# EAGLE design AnyDiversityProv2 (EAGLE 6.4)
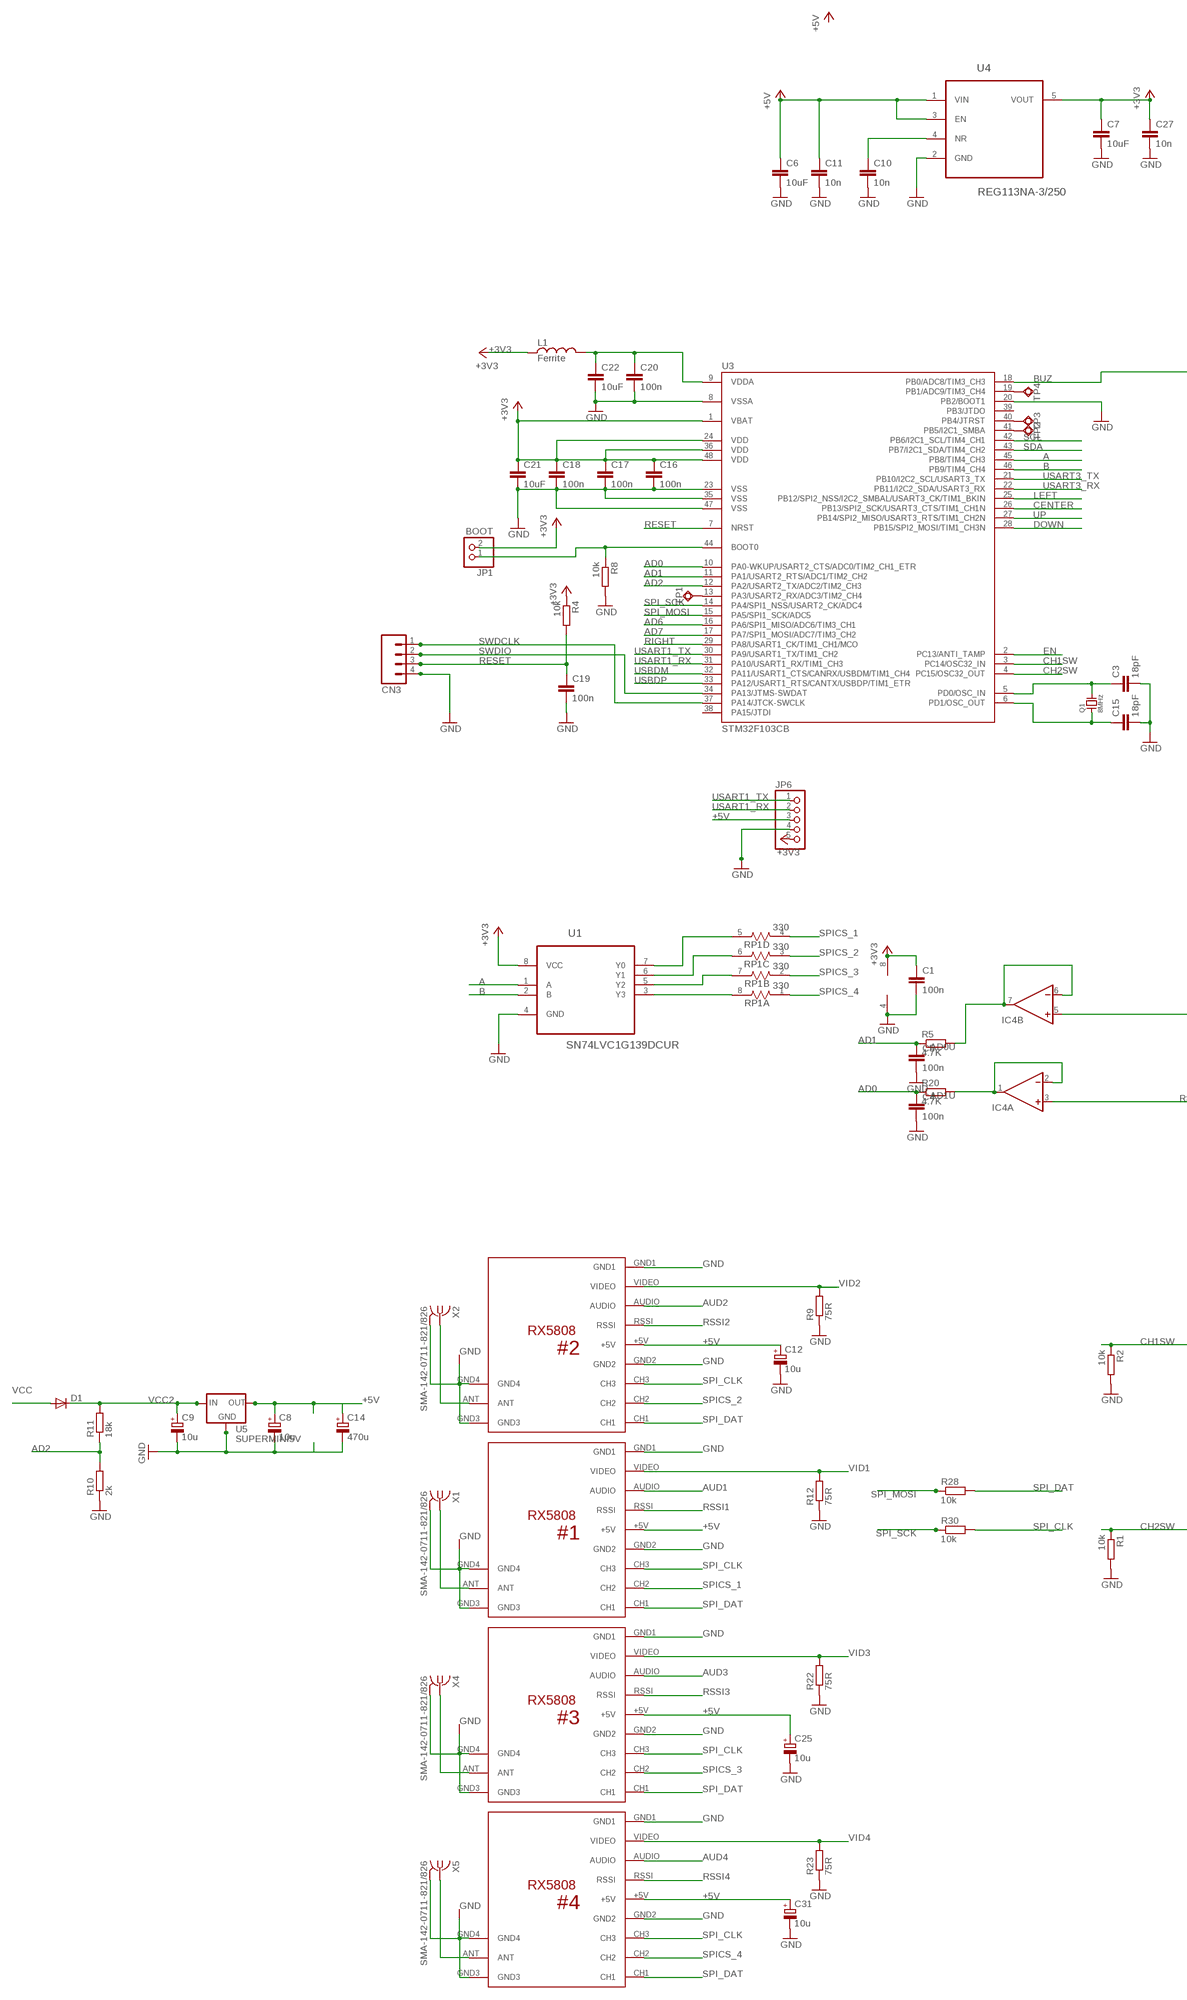
[diagram p0: schematic, sheet 1, part 1 of 3]
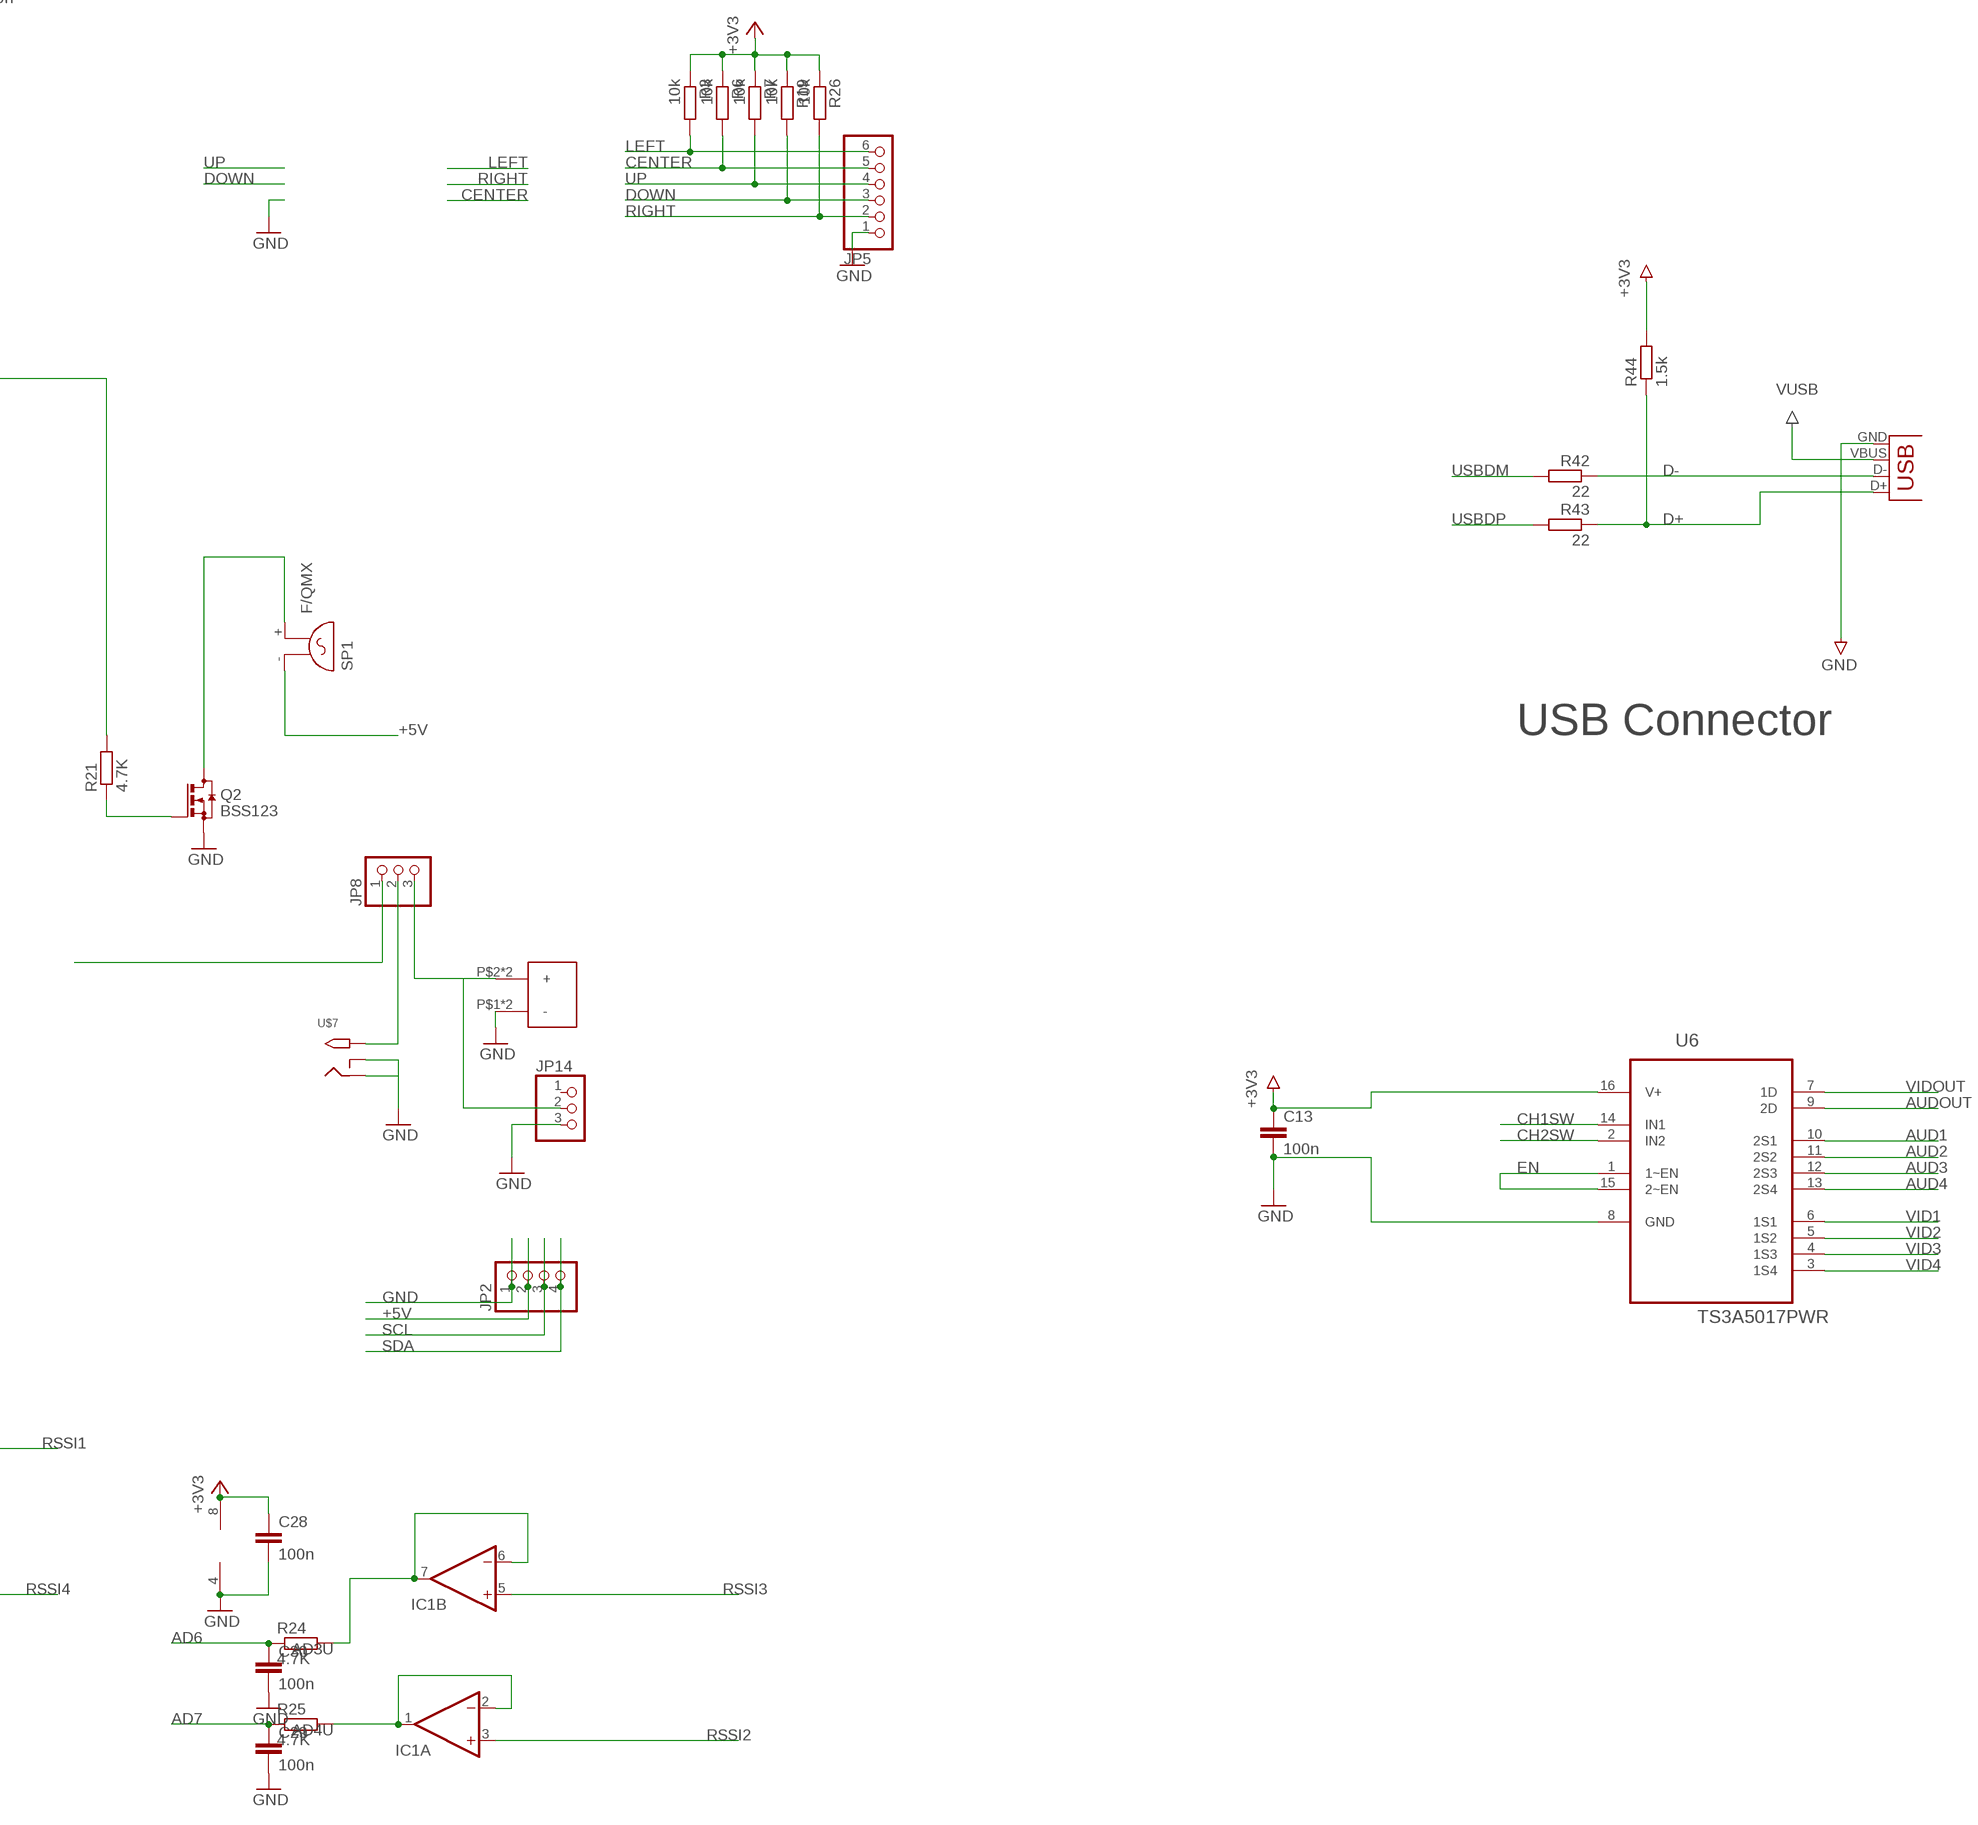
[diagram p1: schematic, sheet 1, part 2 of 3]
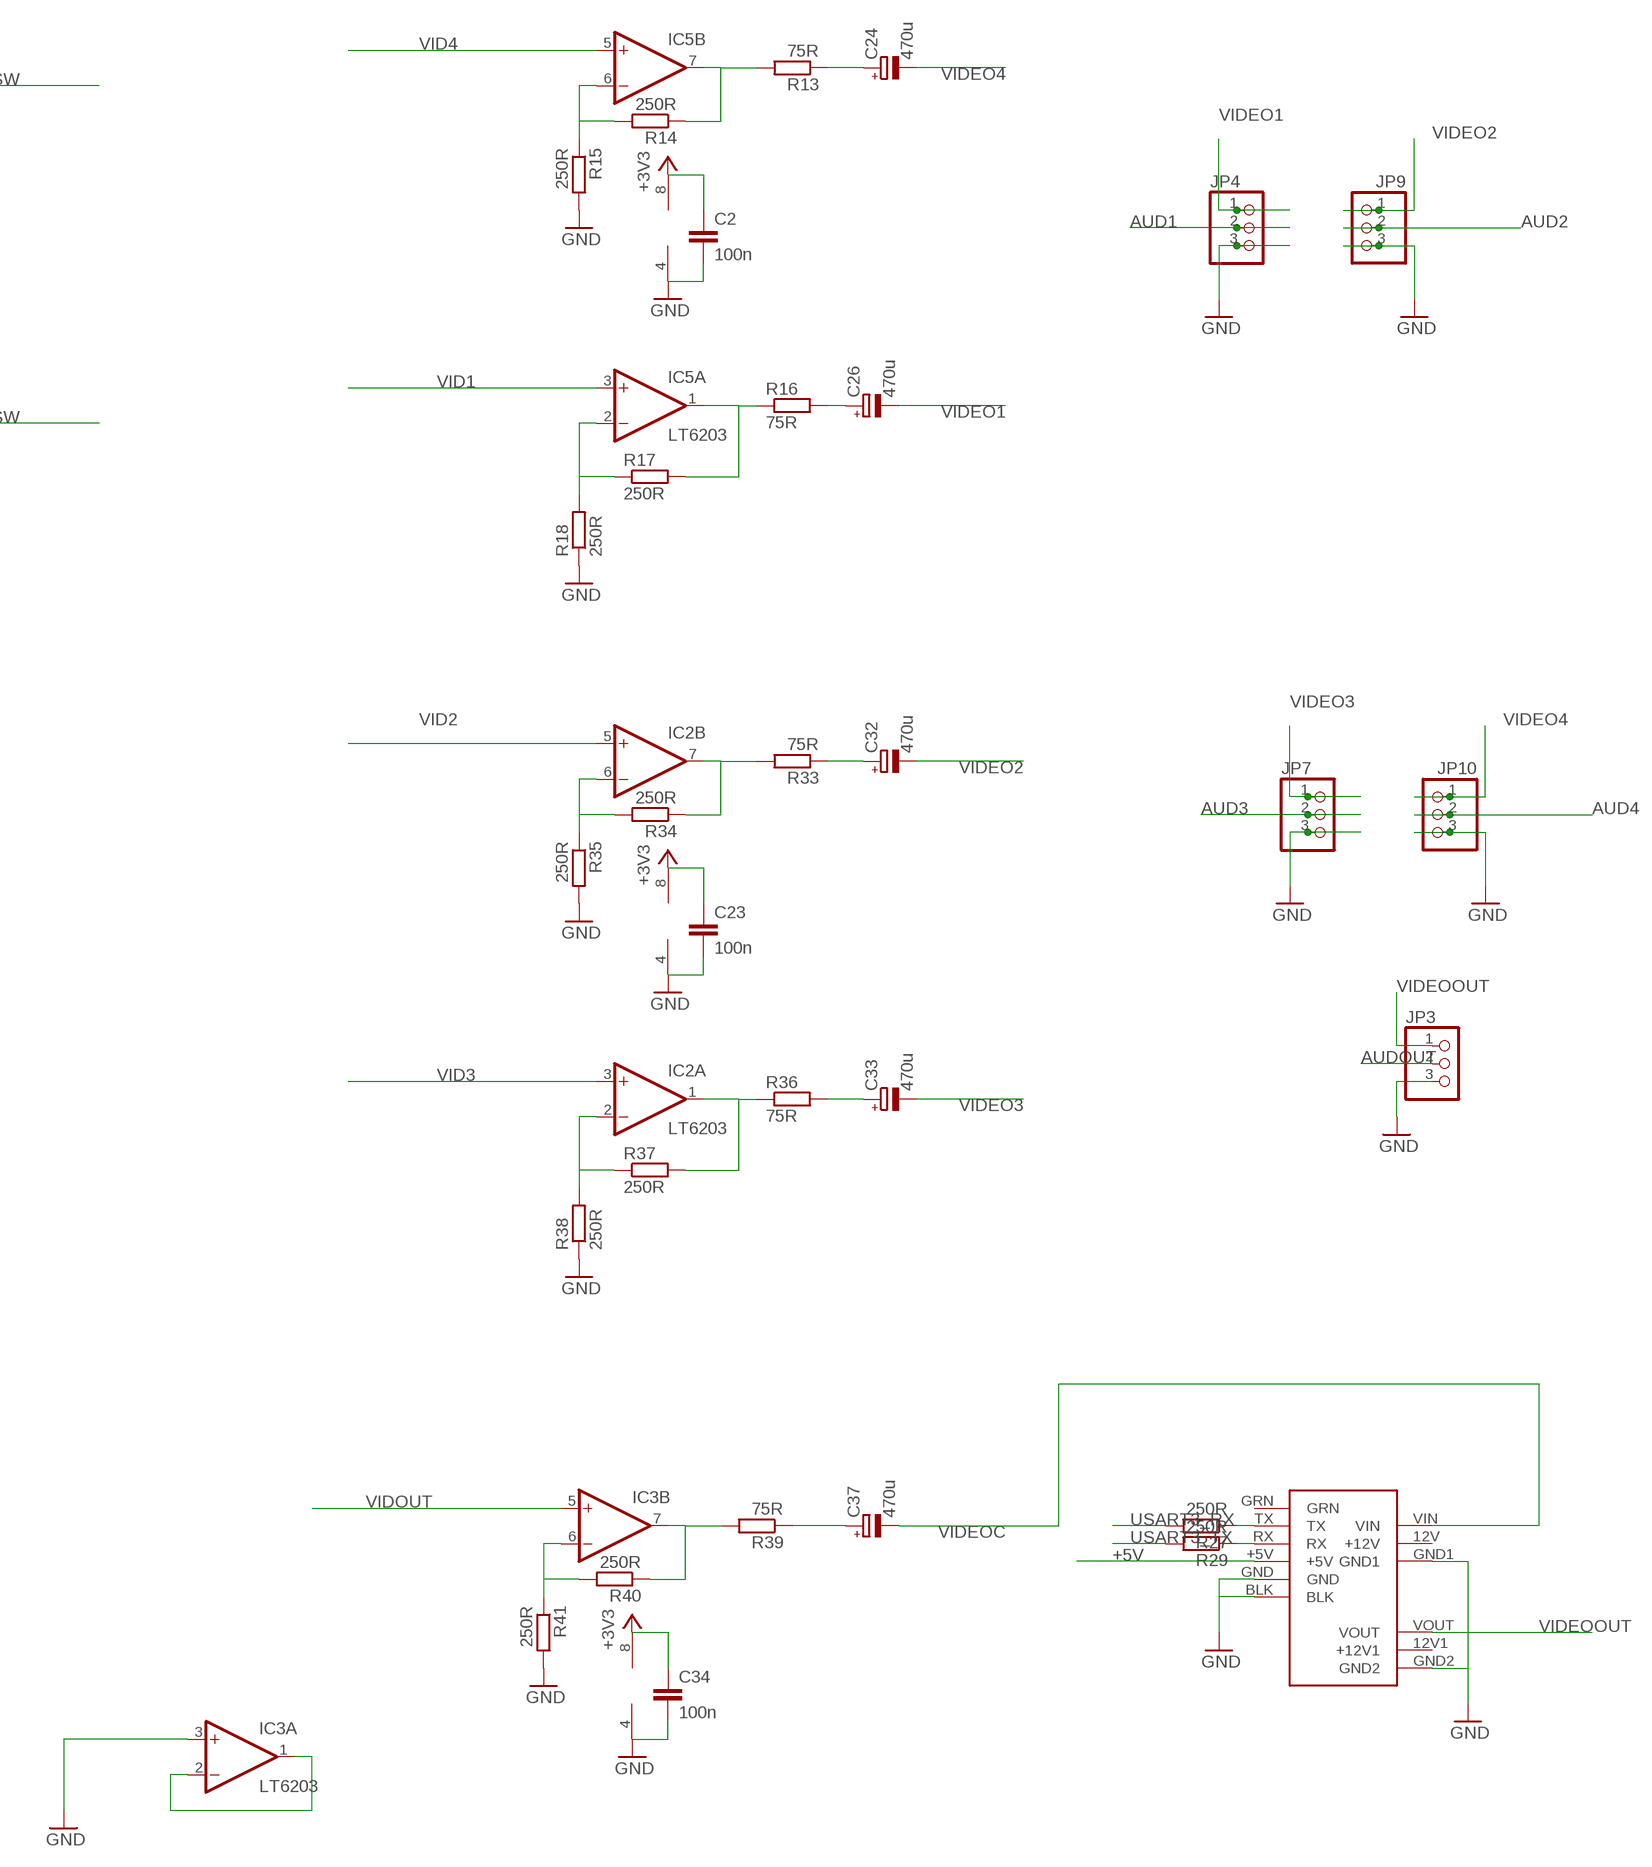
[diagram p2: schematic, sheet 1, part 3 of 3]

## Parts
C1  100n  C-EUC0603K  [C0603K]
C2  100n  C-EUC0603K  [C0603K]
C3  18pF  CAPACITOR0603  [0603]
C4  100n  C-EUC0603K  [C0603K]
C5  100n  C-EUC0603K  [C0603K]
C6  10uF  C-EUC0805K  [C0805K]
C7  10uF  C-EUC0805K  [C0805K]
C8  10u  CPOL-EUA/3216-18W  [A/3216-18W]
C9  10u  CPOL-EUA/3216-18W  [A/3216-18W]
C10  10n  C-EUC0603K  [C0603K]
C11  10n  C-EUC0603K  [C0603K]
C12  10u  CPOL-EUA/3216-18W  [A/3216-18W]
C13  100n  C-EUC0603K  [C0603K]
C14  470u  CPOL-EUE  [PANASONIC_E]
C15  18pF  CAPACITOR0603  [0603]
C16  100n  C-EUC0603K  [C0603K]
C17  100n  C-EUC0603K  [C0603K]
C18  100n  C-EUC0603K  [C0603K]
C19  100n  C-EUC0603K  [C0603K]
C20  100n  C-EUC0603K  [C0603K]
C21  10uF  C-EUC0805K  [C0805K]
C22  10uF  C-EUC0805K  [C0805K]
C23  100n  C-EUC0603K  [C0603K]
C24  470u  CPOL-EUE  [PANASONIC_E]
C25  10u  CPOL-EUA/3216-18W  [A/3216-18W]
C26  470u  CPOL-EUE  [PANASONIC_E]
C27  10n  C-EUC0603K  [C0603K]
C28  100n  C-EUC0603K  [C0603K]
C29  100n  C-EUC0603K  [C0603K]
C30  100n  C-EUC0603K  [C0603K]
C31  10u  CPOL-EUA/3216-18W  [A/3216-18W]
C32  470u  CPOL-EUE  [PANASONIC_E]
C33  470u  CPOL-EUE  [PANASONIC_E]
C34  100n  C-EUC0603K  [C0603K]
C37  470u  CPOL-EUE  [PANASONIC_E]
CN3  SM04B-SRSS-TB  [SM04B-SRSS-TB]
D1  DIODE-DO214AA  [DO214AA]
IC1  LMV358  AD648D  [SO08]
IC2  LT6203  AD648D  [SO08]
IC3  LT6203  AD648D  [SO08]
IC4  LMV358  AD648D  [SO08]
IC5  LT6203  AD648D  [SO08]
JP1  BOOT  PINHD-1X02_2.54-S  [1X02-S]
JP2  PINHD-1X04_2.54-S  [1X04-S]
JP3  PINHD-1X03_2.54-S  [1X03-S]
JP4  PINHD-1X03_2.54-S  [1X03-S]
JP5  PINHD-1X06_2.00  [1X06M]
JP6  PINHD-1X05_2.54-S  [1X05-S]
JP7  PINHD-1X03_2.54-S  [1X03-S]
JP8  PINHD-1X03_2.54-S  [1X03-S]
JP9  PINHD-1X03_2.54-S  [1X03-S]
JP10  PINHD-1X03_2.54-S  [1X03-S]
JP14  PINHD-1X03_2.54-S  [1X03-S]
L1  Ferrite  INDUCTOR0603  [0603]
Q1  8MHz  CRYSTAL-5X3  [CRYSTAL-5X3]
Q2  BSS123  [SOT23]
R1  10k  R-EU_R0603  [R0603]
R2  10k  R-EU_R0603  [R0603]
R3  10k  R-EU_R0603  [R0603]
R4  10k  R-EU_R0603  [R0603]
R5  4.7K  R-EU_R0603  [R0603]
R6  10k  R-EU_R0603  [R0603]
R7  10k  R-EU_R0603  [R0603]
R8  10k  R-EU_R0603  [R0603]
R9  75R  R-EU_R0603  [R0603]
R10  2k  R-EU_R0603  [R0603]
R11  18k  R-EU_R0603  [R0603]
R12  75R  R-EU_R0603  [R0603]
R13  75R  R-EU_R0603  [R0603]
R14  250R  R-EU_R0603  [R0603]
R15  250R  R-EU_R0603  [R0603]
R16  75R  R-EU_R0603  [R0603]
R17  250R  R-EU_R0603  [R0603]
R18  250R  R-EU_R0603  [R0603]
R19  10k  R-EU_R0603  [R0603]
R20  4.7K  R-EU_R0603  [R0603]
R21  4.7K  R-EU_R0603  [R0603]
R22  75R  R-EU_R0603  [R0603]
R23  75R  R-EU_R0603  [R0603]
R24  4.7K  R-EU_R0603  [R0603]
R25  4.7K  R-EU_R0603  [R0603]
R26  10k  R-EU_R0603  [R0603]
R27  250R  R-EU_R0603  [R0603]
R28  10k  R-EU_R0603  [R0603]
R29  250R  R-EU_R0603  [R0603]
R30  10k  R-EU_R0603  [R0603]
R33  75R  R-EU_R0603  [R0603]
R34  250R  R-EU_R0603  [R0603]
R35  250R  R-EU_R0603  [R0603]
R36  75R  R-EU_R0603  [R0603]
R37  250R  R-EU_R0603  [R0603]
R38  250R  R-EU_R0603  [R0603]
R39  75R  R-EU_R0603  [R0603]
R40  250R  R-EU_R0603  [R0603]
R41  250R  R-EU_R0603  [R0603]
R42  22  R-EU_R0603  [R0603]
R43  22  R-EU_R0603  [R0603]
R44  1.5k  R-EU_R0603  [R0603]
RP1  330  RES4NT  [RES4NT]
SP1  F/QMX  [F/QMX]
TP1  TPSQB1,27  [B1,27]
TP2  TPSQB1,27  [B1,27]
TP3  TPSQB1,27  [B1,27]
TP4  TPSQB1,27  [B1,27]
U1  SN74LVC1G139DCUR  [SOP50P310X90-8N]
U3  STM32F103CB  [LQFP48]
U4  REG113NA-3/250  [SOT95P280X145-5N]
U5  SUPERMINI5V  [SUPERMINI5V]
U6  TS3A5017PWR  [SOP65P640X120-16N]
U$1  1CUSTOMSTUFF_RX5808  [1CUSTOMSTUFF_RX5808]
U$2  1CUSTOMSTUFF_RX5808  [1CUSTOMSTUFF_RX5808]
U$3  1CUSTOMSTUFF_RX5808  [1CUSTOMSTUFF_RX5808]
U$4  1CUSTOMSTUFF_RX5808  [1CUSTOMSTUFF_RX5808]
U$5  MINIMOSD  [MINIMOSD]
U$6  XT60  [XT60]
U$7  2.1MMJACKTHM  [PJ-102A]
X1  SMA-142-0711-821/826  [J502-ND-142-0711-821/826]
X2  SMA-142-0711-821/826  [J502-ND-142-0711-821/826]
X3  USBSMD  [USB-MINIB]
X4  SMA-142-0711-821/826  [J502-ND-142-0711-821/826]
X5  SMA-142-0711-821/826  [J502-ND-142-0711-821/826]

## Nets
+3V3: C1.1 C2.1 C7.1 C13.1 C16.1 C17.1 C18.1 C21.1 C23.1 C27.1 C28.1 C34.1 IC1.8(P:V+) IC2.8(P:V+) IC3.8(P:V+) IC4.8(P:V+) IC5.8(P:V+) JP1.2 JP6.5 L1.1 R3.1 R4.1 R6.1 R7.1 R19.1 R26.1 R44.2 U1.8(VCC) U3.1(VBAT) U3.24(VDD) U3.36(VDD) U3.48(VDD) U4.5(VOUT) U6.16(V+)
+5V: C6.1 C8.+ C11.1 C12.+ C14.+ C25.+ C31.+ JP2.2 JP6.3 JP8.1 SP1.- U4.1(VIN) U4.3(EN) U5.1(OUT) U5.2(OUT1) U$1.+5V U$2.+5V U$3.+5V U$4.+5V U$5.+5V
A: U1.1(A) U3.45(PB8/TIM4_CH3)
AD0: C4.1 R20.1 U3.10(PA0-WKUP/USART2_CTS/ADC0/TIM2_CH1_ETR)
AD0U: IC4.6(B:-IN) IC4.7(B:OUT) R5.2
AD1: C5.1 R5.1 U3.11(PA1/USART2_RTS/ADC1/TIM2_CH2)
AD1U: IC4.1(A:OUT) IC4.2(A:-IN) R20.2
AD2: R10.2 R11.1 U3.12(PA2/USART2_TX/ADC2/TIM2_CH3)
AD3U: IC1.6(B:-IN) IC1.7(B:OUT) R24.2
AD4U: IC1.1(A:OUT) IC1.2(A:-IN) R25.2
AD6: C30.1 R24.1 U3.16(PA6/SPI1_MISO/ADC6/TIM3_CH1)
AD7: C29.1 R25.1 U3.17(PA7/SPI1_MOSI/ADC7/TIM3_CH2)
ANT: U$3.ANT X2.1
ANT1: U$2.ANT X1.1
ANT2: U$1.ANT X4.1
ANT3: U$4.ANT X5.1
AUD1: JP4.2 U6.10(2S1) U$2.AUDIO
AUD2: JP9.2 U6.11(2S2) U$3.AUDIO
AUD3: JP7.2 U6.12(2S3) U$1.AUDIO
AUD4: JP10.2 U6.13(2S4) U$4.AUDIO
AUDOUT: JP3.2 U6.9(2D)
B: U1.2(B) U3.46(PB9/TIM4_CH4)
BUZ: R21.2 U3.18(PB0/ADC8/TIM3_CH3)
CENTER: JP5.5 R6.2 U3.26(PB13/SPI2_SCK/USART3_CTS/TIM1_CH1N)
CH1SW: R2.1 U3.3(PC14/OSC32_IN) U6.14(IN1)
CH2SW: R1.1 U3.4(PC15/OSC32_OUT) U6.2(IN2)
D+: R43.1 R44.1 X3.D+
D-: R42.1 X3.D-
DOWN: JP5.3 R19.2 U3.28(PB15/SPI2_MOSI/TIM1_CH3N)
EN: U3.2(PC13/ANTI_TAMP) U6.1(1~EN) U6.15(2~EN)
GND: C1.2 C2.2 C3.2 C4.2 C5.2 C6.2 C7.2 C8.- C9.- C10.2 C11.2 C12.- C13.2 C14.- C15.2 C16.2 C17.2 C18.2 C19.2 C20.2 C21.2 C22.2 C23.2 C25.- C27.2 C28.2 C29.2 C30.2 C31.- C34.2 CN3.4 IC1.4(P:V-) IC2.4(P:V-) IC3.3(A:+IN) IC3.4(P:V-) IC4.4(P:V-) IC5.4(P:V-) JP2.1 JP3.3 JP4.3 JP5.1 JP6.4 JP7.3 JP9.3 JP10.3 JP14.3 Q2.2(S) R1.2 R2.2 R8.2 R9.1 R10.1 R12.1 R15.2 R18.1 R22.1 R23.1 R35.2 R38.1 R41.2 U1.4(GND) U3.8(VSSA) U3.20(PB2/BOOT1) U3.23(VSS) U3.35(VSS) U3.47(VSS) U4.2(GND) U5.5(GND) U5.6(GND1) U5.7(GND2) U5.8(GND3) U6.8(GND) U$1.GND1 U$1.GND2 U$1.GND3 U$1.GND4 U$2.GND1 U$2.GND2 U$2.GND3 U$2.GND4 U$3.GND1 U$3.GND2 U$3.GND3 U$3.GND4 U$4.GND1 U$4.GND2 U$4.GND3 U$4.GND4 U$5.BLK U$5.GND U$5.GND1 U$5.GND2 U$6.P$1(-) U$6.P$3(-) U$7.RING U$7.RING_SW X1.G@1 X1.G@2 X1.G@3 X1.G@4 X2.G@1 X2.G@2 X2.G@3 X2.G@4 X3.GND X4.G@1 X4.G@2 X4.G@3 X4.G@4 X5.G@1 X5.G@2 X5.G@3 X5.G@4
LEFT: JP5.6 R3.2 U3.25(PB12/SPI2_NSS/I2C2_SMBAL/USART3_CK/TIM1_BKIN)
N$1: C26.+ R16.2
N$2: C24.+ R13.1
N$3: C10.1 U4.4(NR)
N$4: Q2.1(G) R21.1
N$5: Q2.3(D) SP1.+
N$6: RP1.5 U1.7(Y0)
N$7: RP1.6 U1.6(Y1)
N$8: IC2.6(B:-IN) R34.2 R35.1
N$9: IC2.7(B:OUT) R33.2 R34.1
N$10: IC2.2(A:-IN) R37.1 R38.2
N$11: IC2.1(A:OUT) R36.1 R37.2
N$12: RP1.7 U1.5(Y2)
N$13: C33.+ R36.2
N$14: RP1.8 U1.3(Y3)
N$15: C32.+ R33.1
N$16: R29.1 U$5.RX
N$17: R27.1 U$5.TX
N$19: IC5.6(B:-IN) R14.2 R15.1
N$20: IC3.6(B:-IN) R40.2 R41.1
N$21: IC5.7(B:OUT) R13.2 R14.1
N$22: IC5.2(A:-IN) R17.1 R18.2
N$24: IC5.1(A:OUT) R16.1 R17.2
N$25: C20.1 C22.1 L1.2 U3.9(VDDA)
N$26: JP1.1 R8.1 U3.44(BOOT0)
N$27: IC3.7(B:OUT) R39.2 R40.1
N$28: IC3.1(A:OUT) IC3.2(A:-IN)
N$29: JP8.2 U$7.TIP
N$30: C3.1 Q1.3 U3.5(PD0/OSC_IN)
N$31: C37.+ R39.1
N$32: C15.1 Q1.1 U3.6(PD1/OSC_OUT)
N$33: TP1.TP U3.13(PA3/USART2_RX/ADC3/TIM2_CH4)
N$34: TP3.TP U3.40(PB4/JTRST)
N$35: TP4.TP U3.19(PB1/ADC9/TIM3_CH4)
N$36: TP2.TP U3.41(PB5/I2C1_SMBA)
RESET: C19.1 CN3.3 R4.2 U3.7(NRST)
RIGHT: JP5.2 R26.2 U3.29(PA8/USART1_CK/TIM1_CH1/MCO)
RSSI1: IC4.5(B:+IN) U$2.RSSI
RSSI2: IC1.3(A:+IN) U$3.RSSI
RSSI3: IC1.5(B:+IN) U$1.RSSI
RSSI4: IC4.3(A:+IN) U$4.RSSI
SCL: JP2.3 U3.42(PB6/I2C1_SCL/TIM4_CH1)
SDA: JP2.4 U3.43(PB7/I2C1_SDA/TIM4_CH2)
SPI_CLK: R30.2 U$1.CH3 U$2.CH3 U$3.CH3 U$4.CH3
SPI_DAT: R28.2 U$1.CH1 U$2.CH1 U$3.CH1 U$4.CH1
SPI_MOSI: R28.1 U3.15(PA5/SPI1_SCK/ADC5)
SPI_SCK: R30.1 U3.14(PA4/SPI1_NSS/USART2_CK/ADC4)
SPICS_1: RP1.4 U$2.CH2
SPICS_2: RP1.3 U$3.CH2
SPICS_3: RP1.2 U$1.CH2
SPICS_4: RP1.1 U$4.CH2
SWDCLK: CN3.1 U3.37(PA14/JTCK-SWCLK)
SWDIO: CN3.2 U3.34(PA13/JTMS-SWDAT)
UP: JP5.4 R7.2 U3.27(PB14/SPI2_MISO/USART3_RTS/TIM1_CH2N)
USART1_RX: JP6.2 U3.31(PA10/USART1_RX/TIM1_CH3)
USART1_TX: JP6.1 U3.30(PA9/USART1_TX/TIM1_CH2)
USART3_RX: R27.2 U3.22(PB11/I2C2_SDA/USART3_RX)
USART3_TX: R29.2 U3.21(PB10/I2C2_SCL/USART3_TX)
USBDM: R42.2 U3.32(PA11/USART1_CTS/CANRX/USBDM/TIM1_CH4)
USBDP: R43.2 U3.33(PA12/USART1_RTS/CANTX/USBDP/TIM1_ETR)
VCC: D1.A JP8.3 JP14.2 U$6.P$2(+) U$6.P$4(+)
VCC2: C9.+ D1.C R11.2 U5.3(IN) U5.4(IN1)
VID1: IC5.3(A:+IN) R12.2 U6.6(1S1) U$2.VIDEO
VID2: IC2.5(B:+IN) R9.2 U6.5(1S2) U$3.VIDEO
VID3: IC2.3(A:+IN) R22.2 U6.4(1S3) U$1.VIDEO
VID4: IC5.5(B:+IN) R23.2 U6.3(1S4) U$4.VIDEO
VIDEO1: C26.- JP4.1
VIDEO2: C32.- JP9.1
VIDEO3: C33.- JP7.1
VIDEO4: C24.- JP10.1
VIDEOC: C37.- U$5.VIN
VIDEOOUT: JP3.1 U$5.VOUT
VIDOUT: IC3.5(B:+IN) U6.7(1D)
VUSB: X3.VBUS
Unconnected: JP14.1 U3.38(PA15/JTDI) U3.39(PB3/JTDO) U$5.12V1(+12V1) U$5.12V(+12V) U$5.GRN

## Notes on the sheet
- USB Connector
- #2
- #1
- #3
- #4

## Library data of the parts
C1 C2 C4-C7 C10 C11 C13 C16-C23 C27-C30 C34 = rcl:C-EU: CAPACITOR, European symbol
C3 C15 = OpenPilot:CAPACITOR: Capacitor Standard SMD ceramic capacitors.
C8 C9 C12 C14 C24-C26 C31-C33 C37 = rcl:CPOL-EU: POLARIZED CAPACITOR, European symbol
CN3 = AnyDiversity4:SM04B-SRSS-TB: JST SR Connector 4 pins, SMT (Side entry)
D1 = diode:DIODE-: DIODE
IC1-IC5 = linear:AD648: OP AMP
JP1 = pinhead-2:PINHD-1X02: PIN HEADER
JP2 = pinhead-2:PINHD-1X04: PIN HEADER
JP3 JP4 JP7-JP10 JP14 = pinhead-2:PINHD-1X03: PIN HEADER
JP5 = pinhead-2:PINHD-1X06: PIN HEADER
JP6 = pinhead-2:PINHD-1X05: PIN HEADER
L1 = OpenPilot:INDUCTOR
Q1 = OpenPilot:CRYSTAL: 5x3 Part: Digikey part: CTX639CT-ND or 535-9720-1-ND
Q2 = transistor-small-signal:BSS123: N-CHANNEL MOS FET
R1-R30 R33-R44 = rcl:R-EU_: RESISTOR, European symbol
RP1 = MySMD:RES4NT
SP1 = buzzer:F/QMX: BUZZER Source: Buerklin; OC_FARNELL: unknown; OC_NEWARK: unknown
TP1-TP4 = testpad:TPSQ: Test pad
U1 = SN74LVC1G139DCUR:SN74LVC1G139DCUR: 2-TO-4 LINE DECODER,VSSOP-8; MPN: SN74LVC1G139DCUR; OC_FARNELL: Unknown; OC_NEWARK: 94T5047; PACKAGE: VSSOP-8; SUPPLIER: TEXAS INSTRUMENTS
U3 = AnyDiversity4:STM32F103C: ST Microelectronics STM32 Device: STM32F103Cx Package: 48LQFP
U4 = REG113NA:REG113NA-3/250: DMOS 400mA Low-Dropout Regulator; MPN: REG113NA-3/250; OC_FARNELL: 1575540; OC_NEWARK: 75C7591; PACKAGE: SOT-23-5; SUPPLIER: Texas Instruments
U5 = AnyDiversity4:SUPERMINI5V
U6 = TS3A5017PWR:TS3A5017PWR: Dual single-pole quadruple-throw analog switch; MPN: TS3A5017PWR; OC_FARNELL: 1755402; OC_NEWARK: 34R9265; PACKAGE: TSSOP-16; SUPPLIER: Texas Instruments
U$1-U$4 = AnyDiversity4:1CUSTOMSTUFF_RX5808
U$5 = MinimOSD:MINIMOSD
U$6 = AnyDiversity4:XT60
U$7 = adafruit:2.1MMJACK: 2.1mm x 5.5mm THM DC jack with internal switch. Digikey part #PJ-102A, 4UCON part #05537 2.1mm x 5.5mm SMT DC jack with internal switch. Digikey part #PJ-002A-SMT, 4UCON part #03267 By microbuilder.eu & adafruit.com
X1 X2 X4 X5 = con-coax:SMA-: SMA 50 Ohm End Launch Jack Receptacle - Round Contact Johnson Components Source: www.johnsoncomponents.com .. J502-ND.pdf; MF: JOHNSON COMPONENTS; MPN: 142-0711-821; OC_FARNELL: 1019328; OC_NEWARK: 16F3627
X3 = sparkfun:USB: USB Connectors USB-B-PTH is fully proven SKU : PRT-00139 USB-miniB is fully proven SKU : PRT-00587 USB-A-PCB is untested. USB-A-H is throughly reviewed, but untested. Spark Fun Electronics SKU : PRT-00437 USB-B-SMT is throughly reviewed, but untested. Needs silkscreen touching up. USB-A-S has not been used/tested USB-MB-H has not been used/tested

## Net classes
1 power: width 0.254 mm, drill 0.33 mm, clearance 0.152 mm

## Board
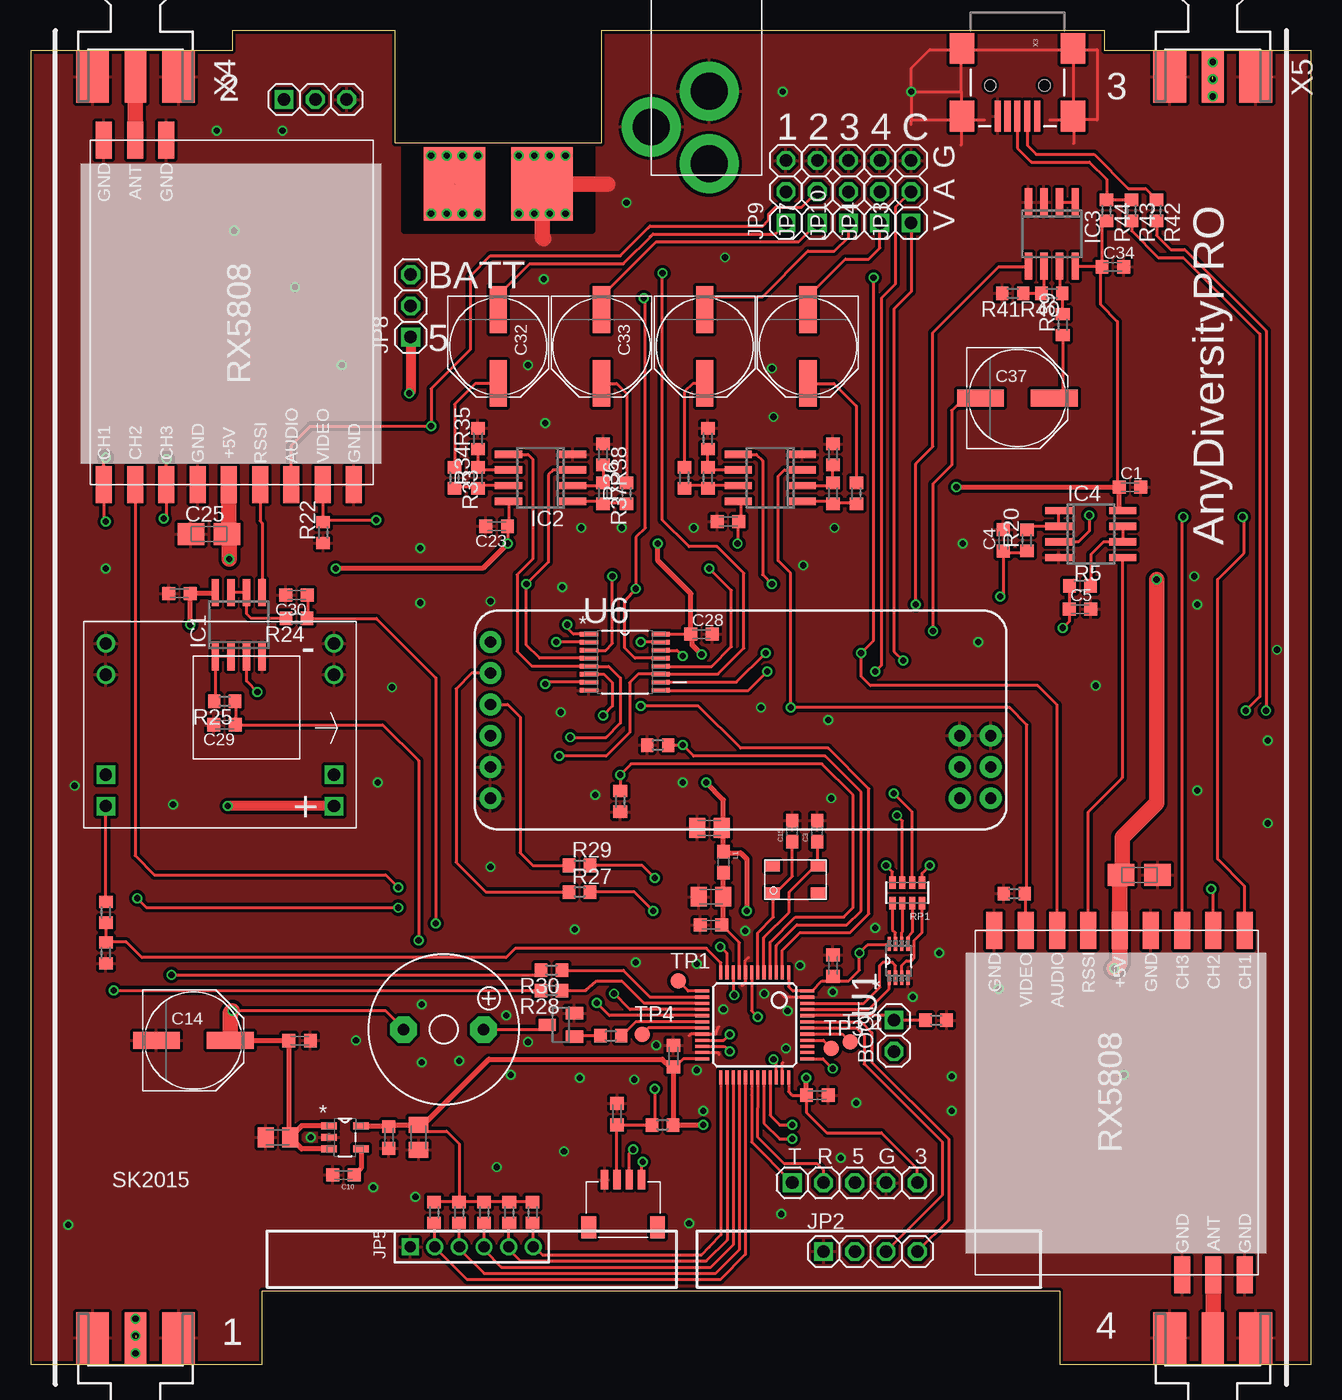
[diagram p3: board, top side]
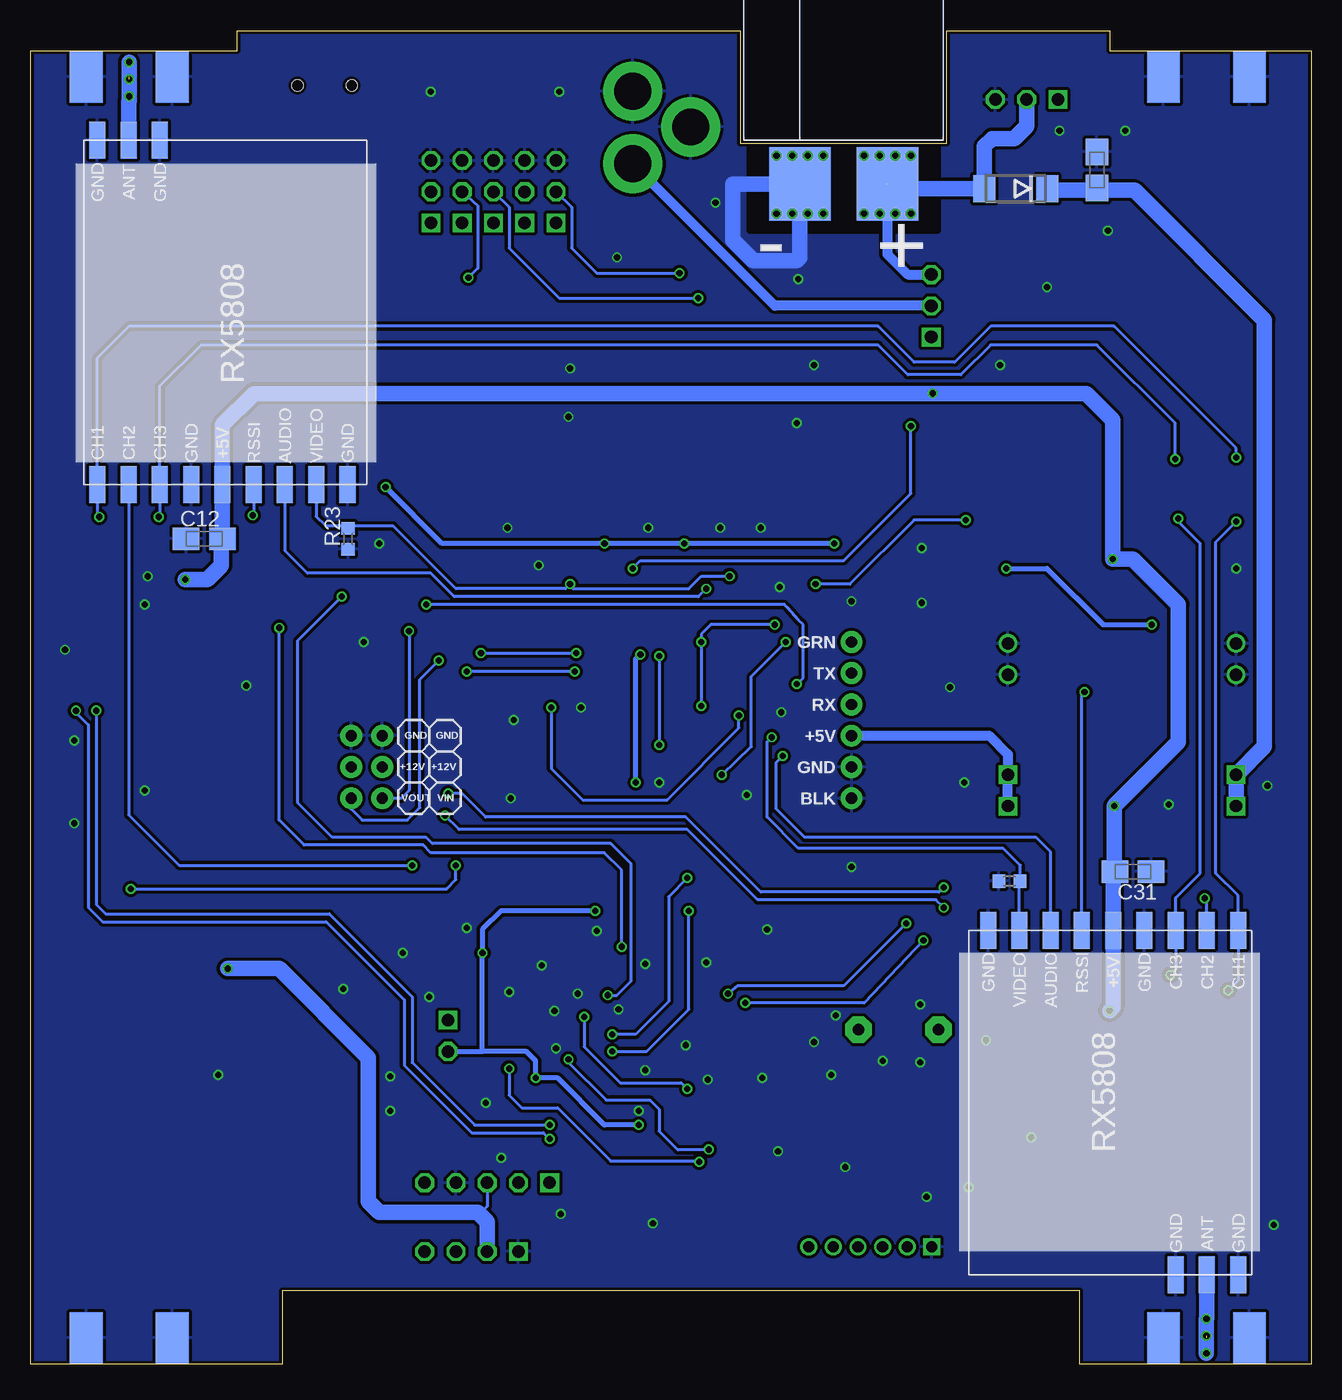
[diagram p4: board, bottom side, seen from below]

Size 104 x 108.33 mm. Coordinates in mm from the lower left corner, seen from the top.
Outline: 104,0 104,106.7 87.25,106.7 87.25,108.33 46.35,108.33 46.35,99.19 29.59,99.19 29.59,108.33 16.38,108.33 16.38,106.7 0,106.7 0,0 18.8,0 18.8,5.97 83.57,5.97 83.57,0 104,0
Copper layers (1*2*15*16): Top 0.035mm / dielectric 0.2mm / Route2 0.0175mm / dielectric 1.1mm / Route15 0.0175mm / dielectric 0.2mm / Bottom 0.035mm
Design rules "SeeedStudio_DRU_no_angle_20130527": minimum track width 6mil, minimum drill 12mil, track to track 6mil, track to pad 6mil, pad to pad 6mil, via to via 6mil, smd to smd 0mil, copper to edge 10mil, drill to drill 10mil, minimum pad ring 6mil, minimum via ring 6mil, stop-mask expansion 2mil, vias tented up to drill 25mil, thermal gap 10mil

### Footprints (pad centres in the part's own frame; a part is rotated, then mirrored left to right if it is on the bottom)
C0603K = smd 1.05 x 1.08: 1 -0.875,0; 2 0.875,0
0603 = smd 1.1 x 1: 1 -0.85,0; 2 0.85,0
C0805K = smd 1.3 x 1.6: 1 -1,0; 2 1,0
A/3216-18W = smd 2.15 x 1.8: + 1.475,0; - -1.475,0
PANASONIC_E = smd 3.8 x 1.4: + 3,0; - -3,0
SM04B-SRSS-TB = smd 0.6 x 1.55: 1 3,0; 2 2,0; 3 1,0; 4 0,0 | smd 1.2 x 1.8: NC@1 -1.3,-3.875; NC@2 4.3,-3.875
DO214AA = smd 1.8 x 2.2: A 2.55,0; C -2.55,0
SO08 = smd 0.6 x 2.2: 1 -1.905,-2.6; 2 -0.635,-2.6; 3 0.635,-2.6; 4 1.905,-2.6; 5 1.905,2.6; 6 0.635,2.6; 7 -0.635,2.6; 8 -1.905,2.6
1X02-S = drill 1.016 square: 1 -1.27,0 | drill 1.016 octagon: 2 1.27,0
1X04-S = drill 1.016 square: 1 -3.81,0 | drill 1.016 octagon: 2 -1.27,0; 3 1.27,0; 4 3.81,0
1X03-S = drill 1.016 square: 1 -2.54,0 | drill 1.016 octagon: 2 0,0; 3 2.54,0
1X06M = drill 0.914 square: 1 -5,0 | drill 0.914: 2 -3,0; 3 -1,0; 4 1,0; 5 3,0; 6 5,0
1X05-S = drill 1.016 square: 1 -5.08,0 | drill 1.016 octagon: 2 -2.54,0; 3 0,0; 4 2.54,0; 5 5.08,0
CRYSTAL-5X3 = smd 1.2 x 0.9: 1 1.85,1.1; 2 -1.85,1.1; 3 -1.85,-1.1; 4 1.85,-1.1
SOT23 = smd 1 x 1.4: 1 -0.95,-1.1; 2 0.95,-1.1; 3 0,1.1
R0603 = smd 1 x 1.1: 1 -0.85,0; 2 0.85,0
RES4NT = smd 0.508 x 1.016: 1 0,0; 2 0.8,0; 3 1.6,0; 4 2.4,0; 5 2.4,1.651; 6 1.6,1.651; 7 0.8,1.651; 8 0,1.651
F/QMX = drill 0.914 pad 2.159 octagon: + 3.251,0; - -3.251,0
B1,27 = smd 1.27 x 1.27: TP 0,0
SOP50P310X90-8N = smd 1.168 x 0.254: 1 -1.372,0.762; 2 -1.372,0.254; 3 -1.372,-0.254; 4 -1.372,-0.762; 5 1.372,-0.762; 6 1.372,-0.254; 7 1.372,0.254; 8 1.372,0.762
LQFP48 = smd 1.143 x 0.254: 1 -4.25,2.75; 2 -4.25,2.25; 3 -4.25,1.75; 4 -4.25,1.25; 5 -4.25,0.75; 6 -4.25,0.25; 7 -4.25,-0.25; 8 -4.25,-0.75; 9 -4.25,-1.25; 10 -4.25,-1.75; 11 -4.25,-2.25; 12 -4.25,-2.75; 25 4.25,-2.75; 26 4.25,-2.25; 27 4.25,-1.75; 28 4.25,-1.25; 29 4.25,-0.75; 30 4.25,-0.25; 31 4.25,0.25; 32 4.25,0.75; 33 4.25,1.25; 34 4.25,1.75; 35 4.25,2.25; 36 4.25,2.75 | smd 0.254 x 1.143: 13 -2.75,-4.25; 14 -2.25,-4.25; 15 -1.75,-4.25; 16 -1.25,-4.25; 17 -0.75,-4.25; 18 -0.25,-4.25; 19 0.25,-4.25; 20 0.75,-4.25; 21 1.25,-4.25; 22 1.75,-4.25; 23 2.25,-4.25; 24 2.75,-4.25; 37 2.75,4.25; 38 2.25,4.25; 39 1.75,4.25; 40 1.25,4.25; 41 0.75,4.25; 42 0.25,4.25; 43 -0.25,4.25; 44 -0.75,4.25; 45 -1.25,4.25; 46 -1.75,4.25; 47 -2.25,4.25; 48 -2.75,4.25
SOT95P280X145-5N = smd 1.27 x 0.559: 1 -1.295,0.94; 2 -1.295,0; 3 -1.295,-0.94; 4 1.295,-0.94; 5 1.295,0.94
SUPERMINI5V = drill 1 square: 1 0,0; 2 0,-2.54; 3 18.542,0; 4 18.542,-2.54 | drill 1: 5 0,-10.668; 6 0,-13.208; 7 18.542,-10.668; 8 18.542,-13.208
SOP65P640X120-16N = smd 1.473 x 0.356: 1 -2.921,2.286; 2 -2.921,1.626; 3 -2.921,0.965; 4 -2.921,0.33; 5 -2.921,-0.33; 6 -2.921,-0.965; 7 -2.921,-1.626; 8 -2.921,-2.286; 9 2.921,-2.286; 10 2.921,-1.626; 11 2.921,-0.965; 12 2.921,-0.33; 13 2.921,0.33; 14 2.921,0.965; 15 2.921,1.626; 16 2.921,2.286
1CUSTOMSTUFF_RX5808 = smd 3 x 1.3: +5V 28,11.26; ANT 0,3.64; AUDIO 28,16.34; CH1 28,1.1; CH2 28,3.64; CH3 28,6.18; GND1 28,21.42; GND2 28,8.72; GND3 0,1.1; GND4 0,6.18; RSSI 28,13.8; VIDEO 28,18.88
MINIMOSD = drill 0.9 pad 1.778: 12V 19.05,-4.445; 12V1 21.59,-4.445; +5V -19.05,-1.905; BLK -19.05,-6.985; GND -19.05,-4.445; GND1 19.05,-1.905; GND2 21.59,-1.905; GRN -19.05,5.715; RX -19.05,0.635; TX -19.05,3.175; VIN 19.05,-6.985; VOUT 21.59,-6.985
XT60 = smd 5 x 6: P$1 -3.55,0; P$2 3.55,0 | smd 5 x 6 bottom: P$3 -3.55,0; P$4 3.55,0
PJ-102A = drill 3 pad 4.8: RING 0.1,-3.39; RING_SW -4.6,-6.29; TIP 0.1,-9.29
J502-ND-142-0711-821/826 = smd 4.191 x 1.778: 1 2.115,0 | smd 4.191 x 2.667: G@1 2.115,3.495; G@2 2.115,-3.495 | smd 4.191 x 2.667 bottom: G@3 2.115,3.495; G@4 2.115,-3.495
USB-MINIB = smd 2.5 x 0.5: D+ 2.5,0; D- 2.5,0.8; GND 2.5,-1.6; ID 2.5,-0.8; VBUS 2.5,1.6 | smd 2.5 x 2: GND@1 -3,-4.5; GND@2 -3,4.5; GND@3 2.5,4.5; GND@4 2.5,-4.5 | hole 0.9: 0,2.2; 0,-2.2

### Placement (x,y rotation side)
C1  89.28,71.25 0 top
C2  56.64,68.45 180 top
C3  63.88,43.31 90 top
C4  78.99,66.93 90 top
C5  85.22,61.34 0 top
C6  20.07,18.41 180 top
C7  31.5,18.41 270 top
C8  90.04,39.75 180 top
C9  17.4,97.03 270 bottom
C10  25.4,15.37 180 top
C11  21.84,26.29 0 top
C12  89.92,67.06 0 bottom
C13  12.06,62.61 180 top
C14  13.21,26.29 0 top
C15  61.85,43.31 90 top
C16  52.2,25.02 90 top
C17  65.15,32.38 90 top
C18  63.88,21.84 0 top
C19  47.62,20.32 90 top
C20  55.24,35.69 180 top
C21  55.12,43.56 180 top
C22  55.24,37.97 180 top
C23  37.85,68.07 180 top
C24  54.74,82.68 270 top
C25  14.48,67.44 0 top
C26  63.12,82.68 270 top
C27  29.08,18.41 270 top
C28  54.48,59.31 0 top
C29  15.75,51.94 180 top
C30  21.59,62.48 180 top
C31  14.48,40 180 bottom
C32  37.97,82.68 270 top
C33  46.35,82.68 270 top
C34  87.88,89.15 0 top
C37  80.14,78.49 0 top
CN3  46.61,14.99 0 top
D1  24,95.5 180 bottom
IC1  16.89,60.07 0 top
IC2  41.4,72.01 90 top
IC3  82.93,91.82 180 top
IC4  86.11,67.44 270 top
IC5  60.07,72.01 90 top
JP1  70.1,26.67 270 top
JP2  68.2,9.14 0 top
JP3  71.5,95.25 90 top
JP4  68.96,95.25 90 top
JP5  35.81,9.53 0 top
JP6  66.93,14.73 0 top
JP7  63.88,95.25 90 top
JP8  30.86,85.98 90 top
JP9  61.34,95.25 90 top
JP10  66.42,95.25 90 top
JP14  23.11,102.74 0 top
L1  56.26,40.77 270 top
Q1  62.1,39.37 180 top
Q2  43.05,27.56 90 top
R1  47.88,45.72 270 top
R2  50.93,50.29 180 top
R3  40.77,12.32 270 top
R4  51.31,19.43 180 top
R5  85.22,63.25 0 top
R6  38.86,12.32 270 top
R7  36.83,12.32 270 top
R8  73.53,27.94 0 top
R9  24.51,39.24 0 bottom
R10  6.1,33.4 90 top
R11  6.1,36.7 90 top
R12  79.88,38.23 0 top
R13  53.09,72.01 270 top
R14  54.99,72.01 90 top
R15  54.99,75.18 90 top
R16  67.06,70.74 90 top
R17  65.15,70.74 270 top
R18  65.15,73.91 270 top
R19  34.8,12.32 270 top
R20  80.9,66.93 90 top
R21  47.12,26.67 0 top
R22  23.75,67.56 90 top
R23  78.23,67.06 90 bottom
R24  21.59,60.58 180 top
R25  15.75,53.85 180 top
R26  32.77,12.32 270 top
R27  44.58,38.35 0 top
R28  42.29,30.35 180 top
R29  44.58,40.51 0 top
R30  42.29,32 180 top
R33  34.42,72.01 270 top
R34  36.32,72.01 90 top
R35  36.32,75.18 90 top
R36  48.39,70.74 90 top
R37  46.48,70.74 270 top
R38  46.48,73.91 270 top
R39  83.82,84.45 90 top
R40  82.93,87 180 top
R41  79.76,87 180 top
R42  91.44,93.73 270 top
R43  89.41,93.73 270 top
R44  87.38,93.73 270 top
RP1  72.39,39.12 180 top
SP1  33.53,27.18 0 top
TP1  52.58,31.11 0 top
TP2  66.55,26.16 0 top
TP3  65.02,25.65 0 top
TP4  49.66,26.8 0 top
U1  70.48,32.77 90 top
U3  58.8,27.56 270 top
U4  25.53,18.41 0 top
U5  24.64,45.34 180 top
U6  48.26,57.02 0 top
U$1  4.83,99.44 270 top
U$2  99.69,7.24 90 top
U$3  4.83,7.24 90 bottom
U$4  99.69,99.44 270 bottom
U$5  56.39,52.96 0 top
U$6  37.97,95.89 0 bottom
U$7  54.99,106.81 0 top
X1  96.01,0 90 top
X2  8.51,0 90 top
X3  80.14,103.89 270 top
X4  8.51,106.7 270 top
X5  96.01,106.7 270 top

### Tracks (layer width: path | path; a pad name or v marks a point on that pad's centre or on a via)
+3V3  (via drill 0.5)
  Top 0.254: IC4.8 88.4,69.41 | IC5.8 57.4,70.04 57.59,70.04 57.66,70.1 57.66,68.57 C2.1 57.4,68.45 v57.4,66.67 | U3.1 61.55,30.65 61.89,30.31 U3.48 63.46,30.31 64.26,31.11 65.15,31.11 | U3.24 53,24.81 52.32,24.13 C16.1 | U3.36 61.55,22.14 61.85,21.84 C18.1 63.01,20.43 64.64,18.8 69.09,18.8 72.01,15.88 JP6.5 | 65.15,31.11 65.07,31.32 C17.1 65.15,31.11 | U6.16 C28.1 | IC2.8 38.8,68.15 C23.1 38.73,68.07 v38.73,66.67 | 65.15,31.11 66.42,31.11 67.31,32 v67.31,33.4 67.94,34.04 69.72,34.04 U1.8 | C1.1 88.39,71.26 88.39,71.25 88.27,71.25 88.27,84.71 86.87,86.11 86.87,89.15 | 86.87,89.15 84.9,89.15 IC3.8 | 86.87,89.15 C34.1 87.01,92.51 R44.2 | C21.1 56.26,43.56 | R26.1 32.77,13.21 34.76,13.21 R19.1 | R19.1 34.8,13.21 36.79,13.21 R7.1 36.83,13.21 38.82,13.21 R6.1 38.86,13.21 40.73,13.21 R3.1 | 31.88,19.43 31.88,19.3 32.26,18.92 33.78,18.92 34.8,17.91 R19.1
  Top 0.406: 88.4,69.41 88.4,71.24 88.39,71.25 C1.1 | U4.5 29.02,19.36 C27.1 29.08,19.43 31.48,19.43 C7.1 31.88,19.43 37.21,24.77 51.31,24.77 51.94,24.13 C16.1 52.2,19.47 R4.1 v54.61,19.43 | C18.1 63.01,21.96 62.99,21.97 v62.99,23.24 | v58.17,36.83 58.17,41.02 57.66,41.53 56.26,41.53 L1.1 56.26,43.56 56.26,45.85 v54.86,47.24 | v75.18,71.25 88.27,71.25 | v50.93,66.67 50.93,65.28 53.61,62.6 C28.1 53.72,59.2 53.72,58.42 v54.48,57.66 | IC1.8 14.99,62.61 C13.1 12.95,62.6 v12.95,60.07 | v38.73,66.67 36.7,64.64 v24.77,64.64
  Bottom 0.406: v38.73,66.67 v50.93,66.67 v57.4,66.67 70.61,66.67 v75.18,71.25 | v54.61,19.43 57.4,19.43 61.21,23.24 v62.99,23.24 62.99,24.64 63.75,25.4 67.31,25.4 | JP1.2 67.31,25.4 | 67.31,25.4 v67.31,33.4 67.31,35.31 65.79,36.83 v58.17,36.83 | v54.86,47.24 54.86,57.28 v54.48,57.66 | v24.77,64.64 21.46,64.64 16.89,60.07 v12.95,60.07
+5V  (via drill 0.5)
  Top 0.254: SP1.- 30.28,27.25 28.83,28.7 v16.38,28.7
  Top 0.406: U4.3 22.01,17.48 C6.1 | U4.1 22.01,19.36 C6.1 | C6.1 20.97,18.51 C11.1 C14.+ | U$1.+5V 16.09,70.82
  Top 0.813: JP8.1 30.86,78.99 v30.73,78.87 | U5.1 v16,45.34 | C14.+ | 88.44,39.62 C8.+ 88.65,39.67
  Top 1.27: U$1.+5V 16.09,67.57 C25.+ 16.13,67.44 v16.13,65.41 | 88.65,39.67 88.65,42.8 91.44,45.59 v91.44,63.75 | v16.38,28.7 16.2,28.52 C14.+ | 88.44,39.62 U$2.+5V 88.44,32.55 v88.01,32.13
  Bottom 0.254: 69.98,12.57 70.23,12.32 | JP6.3 66.93,12.83 67.56,12.19
  Bottom 0.813: U$5.+5V 26.16,51.05 24.64,49.53 U5.2 U5.1
  Bottom 1.27: v91.44,63.75 89.66,63.75 88.52,64.9 88.52,66.93 88.27,66.93 88.39,67.06 C12.+ 88.44,68.08 U$4.+5V 88.44,76.28 85.85,78.87 v30.73,78.87 18.29,78.87 16.13,76.71 v16.13,65.41 14.48,65.41 10.79,61.72 10.79,50.55 v16,45.34 16,40 C31.+ 16.09,40 U$3.+5V 16.09,29 v16.38,28.7 | v88.01,32.13 83.82,32.13 76.58,24.89 76.58,13.21 75.69,12.32 70.23,12.32 67.69,12.32 67.56,12.19 66.93,11.56 JP2.2
A
  Top 0.254: U3.45 68.05,28.81 68.45,29.21 69.72,30.48 U1.1
AD0  (via drill 0.5)
  Top 0.254: R20.1 80.9,65.91 79.14,65.91 C4.1 78.99,62.61 v78.74,62.36 | U3.10 57.05,30.07 v57.15,29.97
  Bottom 0.254: v57.15,29.97 56.39,29.97 55.24,31.11 55.24,40.64 56.9,42.29 71.37,42.29 71.88,42.8 79.5,42.8 82.3,45.59 82.3,58.8 v78.74,62.36
AD0U
  Top 0.254: IC4.7 IC4.6 87.12,66.8 86.11,65.79 86.11,63.29 R5.2
AD1  (via drill 0.5)
  Top 0.254: R5.1 84.33,63.25 84.33,61.47 | 84.33,61.35 C5.1 84.33,61.47 | 84.33,61.47 84.33,61.35 | 84.33,61.35 84.33,60.32 v83.82,59.82 | U3.11 56.55,33.36 v56.01,33.91
  Bottom 0.254: v56.01,33.91 56.01,40.13 57.4,41.53 71.5,41.53 72.14,42.16 81.79,42.16 83.82,44.2 v83.82,59.82
AD1U
  Top 0.254: IC4.1 IC4.2 81.28,68.07 80.99,67.78 R20.2
AD2
  Top 0.254: U3.12 56.05,32.59 54.86,33.78 39.37,33.78 38.61,33.02 9.02,33.02 7.75,34.29 6.1,34.29 | R10.2 6.1,34.29 | R11.1 6.1,34.29
AD3U
  Top 0.254: IC1.7 IC1.6 17.53,60.96 17.91,60.58 20.83,60.58 20.79,60.62 R24.2
AD4U
  Top 0.254: IC1.2 IC1.1 14.99,54.1 14.86,53.97 14.89,53.91 R25.2
AD6  (via drill 0.5)
  Top 0.254: U3.16 48.66,28.81 v47.37,30.1 | 22.48,60.58 28.07,60.58 32.89,55.75 v32.89,35.81 | 22.48,62.48 22.48,60.58 | R24.1 22.48,60.58
  Top 0.406: C30.1 22.48,62.48 22.61,62.48
  Bottom 0.254: v32.89,35.81 37.97,30.73 46.61,30.73 v47.37,30.1
AD7  (via drill 0.5)
  Top 0.254: 16.64,52.07 16.64,52.58 | 16.64,52.58 C29.1 16.64,52.07 | R25.1 16.64,53.85 16.64,52.58 | 16.64,52.07 16.64,51.94 | 16.6,52.03 16.64,51.94 | U3.17 47,28.31 v45.97,29.34 | 16.64,51.94 28.57,51.94 31.5,49.02 v31.5,34.42
  Bottom 0.254: v31.5,34.42 36.32,29.34 v45.97,29.34
ANT  (via drill 0.5)  (1 unrouted)
  Bottom 1.27: U$3.ANT 8.47,3.73 8.51,3.68 v8.51,2.29 8.51,0.89
ANT1
  Top 1.27: U$2.ANT 96.06,3.73 96.01,3.68 X1.1 96.01,0.89
ANT2
  Top 1.27: U$1.ANT 8.47,104.52 X4.1
ANT3  (via drill 0.5)  (1 unrouted)
  Bottom 1.27: U$4.ANT 96.06,102.57 96.01,102.62 v96.01,103 v96.01,104.39 v96.01,105.79
AUD1  (via drill 0.5)
  Top 0.254: v59.69,57.78 57.3,55.4 U6.10 | v68.45,88.27 68.45,58.8 v67.44,57.78 67.44,55.88 68.2,55.12 81.79,55.12 83.36,53.55 U$2.AUDIO
  Bottom 0.254: v67.44,57.78 v59.69,57.78 | JP4.2 67.69,94.11 67.69,89.03 v68.45,88.27
AUD2  (via drill 0.5)
  Top 0.254: v51.31,88.65 51.31,68.58 53.47,66.42 55.75,66.42 57.91,64.26 57.91,58.17 55.8,56.06 U6.11 49.33,56.06 48.64,55.37 48.64,51.31 46.74,49.4 v42.93,49.4
  Bottom 0.254: U$3.AUDIO 21.17,41.61 22.35,42.8 41.15,42.8 43.43,45.08 43.43,48.89 v42.93,49.4 | JP9.2 60.07,93.98 60.07,90.68 58.04,88.65 v51.31,88.65
AUD3  (via drill 0.5)
  Top 0.254: U6.12 55.3,56.69 56.9,58.29 56.9,62.87 v55.12,64.64 | U$1.AUDIO 21.17,74.63 22.73,76.2 v32.51,76.2 32.51,79.25 35.69,82.42 35.69,88.39 37.34,90.04 47.88,90.04 50.29,92.46 | 50.16,92.33 50.29,92.46 | 50.29,92.46 59.44,92.46 59.94,92.96 59.94,93.47 60.45,93.98 62.61,93.98 JP7.2
  Bottom 0.254: v55.12,64.64 54.48,65.28 37.97,65.28 32.51,70.74 v32.51,76.2
AUD4  (via drill 0.5)
  Top 0.254: U6.13 49.07,57.35 48.26,58.17 48.26,61.98 v49.15,62.99 49.15,67.18 49.91,67.95 49.91,86.49 v49.78,86.61
  Bottom 0.254: v49.15,62.99 49.78,62.36 69.6,62.36 71.5,64.26 81.53,64.26 83.36,66.08 U$4.AUDIO | JP10.2 65.15,93.98 65.15,90.68 61.09,86.61 v49.78,86.61
AUDOUT  (via drill 0.5)
  Top 0.254: U6.9 58.29,54.74 v59.82,56.26 | v68.58,56.26 69.09,56.77 69.09,86.61 70.23,87.76 70.23,93.98 JP3.2
  Bottom 0.254: v59.82,56.26 v68.58,56.26
B
  Top 0.254: U3.46 67.66,29.31 68.96,30.61 68.96,32.38 69.22,32.64 69.98,32.64 70.23,32.38 U1.2
BUZ
  Top 0.254: R21.2 48.01,26.67 49.15,27.81 U3.18
CENTER
  Top 0.254: U3.26 56.55,10.07 54.86,8.38 39.75,8.38 38.81,9.32 JP5.5 38.81,11.42 R6.2
CH1SW  (via drill 0.5)
  Top 0.254: U6.14 52.5,57.99 v52.96,57.53 | U3.3 60.55,34.01 62.23,35.69 66.29,35.69 67.44,36.83 67.44,46.48 64.52,49.4 53.85,49.4 v52.96,50.29 R2.1
  Bottom 0.254: v52.96,57.53 v52.96,50.29
CH2SW  (via drill 0.5)
  Top 0.254: U6.2 42.77,58.65 v42.67,58.67 | R1.1 v47.88,47.88 48.77,48.77 64.26,48.77 66.8,46.23 66.8,37.08 66.04,36.32 62.1,36.32 60.05,34.27 U3.4
  Bottom 0.254: v47.88,47.88 45.47,50.16 45.47,55.88 v42.67,58.67
D+
  Top 0.254: X3.D+ 80.14,98.81 81.28,97.66 85.98,97.66 87.38,96.27 87.38,94.62 | R44.1 87.38,94.62 | 87.38,94.62 89.62,94.62 R43.1
D-
  Top 0.254: X3.D- 80.94,99.02 81.66,98.3 86.36,98.3 89.15,95.5 90.55,95.5 91.31,94.74 R42.1
DOWN
  Top 0.254: U3.28 57.55,9.29 55.63,7.37 36.83,7.37 34.81,9.38 JP5.3 34.81,11.45 R19.2
EN  (via drill 0.5)
  Top 0.254: U6.1 44.07,59.31 43.56,59.82 v43.56,60.07 | U6.15 49.55,58.65 v49.53,58.67 | v49.53,53.47 54.23,53.47 57.66,50.04 64.77,50.04 68.07,46.74 68.07,36.58 66.55,35.05 62.48,35.05 61.05,33.62 U3.2
  Bottom 0.254: v43.56,60.07 48.77,60.07 49.53,59.31 v49.53,58.67 v49.53,53.47
GND  (via drill 0.5)
  Top 0.254: 58.29,33.02 58.05,32.78 U3.8 58.05,31 57.78,30.73 | U3.35 61.05,24.48 61.09,24.51 | U3.47 61.25,29.81 60.96,30.1 | U3.23 55.84,25.31 55.88,25.15 | 53.47,26.67 53.61,26.81 U3.20 55.64,26.81 55.88,27.43 | v71.5,103.38 71.5,105.28 73.03,106.81 86.61,106.81 86.61,101.09 84.71,101.09 | v71.5,103.38 71.5,101.09 | 71.5,100.71 71.5,101.09 | 71.5,101.09 77.47,101.09 | v71.5,103.38 75.56,103.38 | 75.56,103.38 75.56,99.06 | 75.56,103.38 75.56,107.7 | 82.8,101.09 84.71,101.09 | 84.71,101.09 84.71,99.19 | 84.71,101.09 84.71,107.44
  Top 0.813: v39.62,98.17 v40.89,98.17 v42.16,98.17 | 43.56,98.17 v43.43,98.17 v42.16,98.17 | v42.16,98.17 42.16,96.01 42.04,95.89
  Top 1.27: 46.86,95.89 42.04,95.89 U$6.P$3 41.52,91.57 41.66,91.44
  Bottom 1.27: U$6.P$3 46.99,95.89 46.99,91.31 45.34,89.66 41.78,89.66 41.53,89.92 U$6.P$3
  other vias: 44.7,67.95 37.34,61.98 48.01,67.95 75.69,66.67 88.77,23.5 29.34,54.99 40.39,26.16 44.2,35.31 38.61,28.32 54.1,32.51 101.22,58.04 43.18,63.12 31.62,66.29 61.34,25.65 61.47,28.7 34.8,24.64 56.26,28.83 54.61,20.57 62.48,32.38 71.63,29.84 26.42,26.29 31.75,29.21 65.28,67.95 53.85,67.95 31.75,24.51 62.74,64.9 60.2,80.9 60.33,76.96 20.45,100.2 21.46,87.5 15.11,100.2 16.51,92.08 78.61,30.48 64.77,52.32 100.46,43.94 94.74,46.61 43.31,17.27 60.96,12.19 74.8,20.57 59.56,30.1 52.96,47.24 45.85,46.23 28.19,47.24 31.62,61.85 37.85,16 27.81,14.35 49.02,23.11 31.24,13.59 38.99,23.5 44.58,23.24 54.1,23.88 53.47,11.43 94.49,64.01 94.74,61.72 25.27,81.15 11.56,45.47 59.31,53.34 43.05,52.96 100.46,50.67 65.15,30.23 56.39,89.92 40.39,81.15 41.66,88.14 48.39,94.36 61.09,103.38 65.02,45.97 76.96,58.67 86.49,55.12 3.05,11.3 3.56,46.99 6.1,64.64 74.8,23.37 73.79,33.4 50.8,25.91 49.15,32.64 37.34,40.39 41.78,76.45 22.73,18.41 58.04,35.18 67.06,21.21 65.79,16.76 68.58,35.43
  pour Bottom (isolate 0.254): 115.57,-14.48 129.41,117.22 -31.37,115.7 -36.58,-10.79
  pour Top (isolate 0.254): 123.95,-11.05 133.86,129.67 -50.8,126.87 -55.37,-16.26
GND1  (via drill 0.5)
  Top 0.813: v39.62,93.47 v40.89,93.47 v42.16,93.47 v43.43,93.47
LEFT
  Top 0.254: U3.25 56.05,10.5 55.12,9.53 54.48,8.89 41.53,8.89 40.89,9.53 JP5.6 40.81,11.42 R3.2
N$1
  Top 0.254: 66.93,71.5 R16.2 67.06,77.85 65.23,79.68 C26.+
N$2
  Top 0.254: C24.+ 53.77,79.68 53.09,78.99 R13.1
N$3
  Top 0.406: U4.4 26.82,15.91 C10.1
N$4
  Top 0.254: R21.1 44.21,26.67 Q2.1
N$5
  Top 0.254: SP1.+ 41.27,27.18 41.66,27.56 Q2.3
N$6
  Top 0.254: U1.7 70.23,35.05 69.99,35.29 RP1.5
N$7
  Top 0.254: U1.6 70.74,35.05 70.79,35.13 RP1.6
N$8
  Top 0.254: R35.1 R34.2 36.32,72.64 IC2.6
N$9
  Top 0.254: IC2.7 36.32,71.37 36.32,71.25 | R34.1 36.32,71.25 | 36.32,71.25 34.16,71.25 R33.2
N$10
  Top 0.254: IC2.2 46.48,71.37 R37.1 R38.2
N$11
  Top 0.254: IC2.1 46.48,70.1 R37.2 46.48,69.98 48.39,69.98 R36.1
N$12
  Top 0.254: U1.5 71.25,34.67 71.59,35.09 RP1.7
N$13
  Top 0.254: C33.+ 47.58,79.68 48.39,78.87 R36.2
N$14
  Top 0.254: U1.3 70.74,32.38 71.12,32.77 71.5,32.77 71.75,33.02 71.75,34.42 72.39,35.05 RP1.8
N$15
  Top 0.254: C32.+ 36.12,79.68 34.42,77.98 R33.1
N$16
  Top 0.254: U$5.RX 38.73,53.59 39.75,52.58 39.75,41.53 40.77,40.51 R29.1
N$17
  Top 0.254: U$5.TX 35.81,56.13 34.54,54.86 34.54,40.77 36.96,38.35 R27.1
N$18  (via drill 0.5)
  other vias: 8.51,3.68
N$19
  Top 0.254: IC5.6 55.31,72.64 R14.2 R15.1
N$20
  Top 0.254: R41.1 R40.2 82.3,87.21 IC3.6
N$21
  Top 0.254: IC5.7 55.31,71.37 R14.1 54.99,71.31 54.8,71.31 54.74,71.37 53.34,71.37 R13.2
N$22
  Top 0.254: IC5.2 65.22,71.37 R17.1 65.15,71.63 | 65.22,71.63 65.15,71.63 | 65.15,71.63 R18.2
N$23  (via drill 0.5)
  other vias: 8.51,0.89
N$24
  Top 0.254: IC5.1 64.96,70.1 R17.2 65.15,69.98 67.06,69.98 R16.1
N$25
  Top 0.254: U3.9 57.55,34.26 C20.1
  Top 0.406: C20.1 56.26,35.69 56.26,37.58 C22.1 56.24,39.9 L1.2
N$26
  Top 0.254: U3.44 69.72,28.31 JP1.1 R8.1
N$27
  Top 0.254: IC3.7 83.57,87.21 R40.1 83.78,85.34 R39.2
N$28
  Top 0.254: IC3.2 IC3.1
N$29
  Bottom 0.813: JP8.2 43.55,85.98 U$7.TIP
N$30
  Top 0.254: U3.5 59.55,34.66 61.59,36.7 61.59,38.35 63.75,40.51 Q1.3 63.88,40.54 C3.1
N$31
  Top 0.254: R39.1 83.82,78.49 C37.+
N$32
  Top 0.254: U3.6 59.05,35.05 60.33,36.32 60.33,38.2 Q1.1 60.49,38.27 61.85,39.62 C15.1
N$33
  Top 0.254: U3.13 53.38,30.31 TP1.TP
N$34
  Top 0.254: U3.40 64.37,26.31 TP3.TP
N$35
  Top 0.254: U3.19 50.17,27.31 TP4.TP
N$36
  Top 0.254: U3.41 65.9,26.81 TP2.TP
RESET  (via drill 0.5)
  Top 0.254: U3.7 58.55,28.71 v59.05,28.19 | CN3.3 47.61,19.41 47.62,19.43 | 47.64,19.45 47.62,19.43 | v50.67,22.35 50.67,19.43 R4.2 47.62,19.43 | C19.1 47.62,19.43
  Bottom 0.254: v59.05,28.19 59.05,25.78 56.13,22.86 51.18,22.86 v50.67,22.35
RIGHT
  Top 0.254: U3.29 58.05,8.9 56.01,6.86 35.43,6.86 32.81,9.48 JP5.2 32.81,11.42 R26.2
RSSI1
  Top 0.254: 88.77,65.53 IC4.5 88.65,65.53 88.65,47.62 86.81,45.78 85.92,44.89 85.89,44.87 U$2.RSSI
RSSI2  (via drill 0.5)
  Top 0.254: IC1.3 17.53,55.49 v18.41,54.61
  Bottom 0.254: U$3.RSSI 18.63,54.4 v18.41,54.61
RSSI3
  Top 0.254: U$1.RSSI 18.63,68.5 18.8,68.33 IC1.5
RSSI4  (via drill 0.5)
  Top 0.254: v85.98,68.96 85.98,67.69 85.09,66.8 IC4.3
  Bottom 0.254: U$4.RSSI 85.89,69 v85.98,68.96
SCL
  Top 0.254: U3.42 67.05,27.31 67.69,26.67 67.69,24.38 74.04,18.03 74.04,13.72 JP2.3
SDA
  Top 0.254: U3.43 67.44,27.81 68.33,26.92 68.33,24.51 74.55,18.29 74.55,11.68 JP2.4
SPI_CLK  (via drill 0.5)
  Top 0.254: v10.79,68.71 11.01,68.92 U$1.CH3 11.01,73.49 v11.05,73.53 | v11.43,31.62 41.15,31.62 R30.2 | U$2.CH3 93.52,68.66 v93.6,68.83
  Bottom 0.254: v10.79,68.71 11.01,68.5 10.84,68.5 9.02,66.67 9.02,39.88 11.01,37.89 U$3.CH3 11.01,32.05 v11.43,31.62 | v11.05,73.53 11.05,76.45 17.4,82.8 26.04,82.8 28.45,80.39 32.77,80.39 35.18,82.8 90.17,82.8 93.52,79.46 U$4.CH3 93.52,68.92 v93.6,68.83
SPI_DAT  (via drill 0.5)
  Top 0.254: v6.1,68.45 5.93,68.66 U$1.CH1 5.93,73.49 v6.1,73.66 | v6.73,30.35 R28.2 41.78,30.35 | U$2.CH1 98.59,38.82 96.39,41.02 96.39,63.75 98.55,65.91 98.55,68.71 v98.42,68.83
  Bottom 0.254: 5.93,68.62 v6.1,68.45 7.75,66.8 7.75,39.88 5.93,38.06 U$3.CH1 5.93,31.16 v6.73,30.35 | v6.1,73.66 6.1,74.42 16,84.33 26.04,84.33 28.96,81.41 32.26,81.41 35.18,84.33 96.01,84.33 98.42,81.92 98.47,81.87 98.59,81.75 U$4.CH1 98.59,69.05 v98.42,68.83
SPI_MOSI
  Top 0.254: U3.15 49.81,29.31 48.01,31.11 45.97,31.11 45.09,30.35 R28.1
SPI_SCK
  Top 0.254: U3.14 50.33,29.81 48.13,32 R30.1
SPICS_1  (via drill 0.5)
  Top 0.254: RP1.4 69.99,39.99 v69.47,40.51 | U$2.CH2 96.06,38.44 v95.89,38.61
  Bottom 0.254: v95.89,38.61 70.23,38.61 69.47,39.37 v69.47,40.51
SPICS_2  (via drill 0.5)
  Top 0.254: RP1.3 70.79,44.14 v70.36,44.58 | v8.64,37.85 9.4,37.08 v29.84,37.08
  Bottom 0.254: v29.84,37.08 30.48,37.72 44.96,37.72 50.67,43.43 69.22,43.43 v70.36,44.58 | U$3.CH2 8.47,37.68 v8.64,37.85
SPICS_3  (via drill 0.5)
  Top 0.254: U$1.CH2 8.47,41.32 10.03,39.75 28.83,39.75 v29.84,38.73 | RP1.2 71.59,44.87 v70.1,46.35
  Bottom 0.254: v29.84,38.73 30.23,38.35 44.7,38.35 50.8,44.45 67.06,44.45 68.96,46.35 v70.1,46.35
SPICS_4  (via drill 0.5)
  Top 0.254: RP1.1 72.39,39.88 v73.03,40.51
  Bottom 0.254: U$4.CH2 96.06,44.62 91.95,40.51 v73.03,40.51
SWDCLK  (via drill 0.5)
  Top 0.254: U3.37 64.34,24.81 v65.15,24 | CN3.1 49.61,16.34 v49.7,16.43
  Bottom 0.254: v65.15,24 65.15,21.84 64.14,20.83 61.21,20.83 56.9,16.51 49.78,16.51 v49.7,16.43
SWDIO  (via drill 0.5)
  Top 0.254: U3.34 60.55,24.54 v60.33,24.77 | CN3.2 48.61,17.11 v48.93,17.43
  Bottom 0.254: v60.33,24.77 60.33,24.51 57.28,21.46 53.72,21.46 52.96,20.7 52.96,18.92 51.44,17.4 49.02,17.4 v48.93,17.43
UP
  Top 0.254: U3.27 57.05,9.68 55.24,7.87 38.23,7.87 36.81,9.29 JP5.4 36.81,11.45 R7.2
USART1_RX
  Top 0.254: U3.31 59.05,21.97 59.05,20.83 59.05,18.41 61.21,16.26 63.88,16.26 64.39,15.75 JP6.2
USART1_TX
  Top 0.254: U3.30 58.55,22.36 58.55,21.84 58.55,18.03 JP6.1
USART3_RX  (via drill 0.5)
  Top 0.254: U3.22 56.36,25.81 v56.77,25.4 | v50.55,36.83 49.02,38.35 R27.2
  Bottom 0.254: v56.77,25.4 53.98,25.4 50.55,28.83 v50.55,36.83
USART3_TX  (via drill 0.5)
  Top 0.254: U3.21 56.28,26.31 v56.77,26.8 | v50.67,39.5 49.66,40.51 R29.2
  Bottom 0.254: v50.67,39.5 52.2,37.97 52.2,29.46 54.86,26.8 v56.77,26.8
USBDM  (via drill 0.5)
  Top 0.254: R42.2 91.44,91.69 92.58,90.55 93.73,90.55 100.33,83.95 v100.33,53.09 | U3.32 59.55,19.57 60.83,18.29 v61.85,18.29
  Bottom 0.254: v100.33,53.09 100.33,52.96 99.31,51.94 99.31,37.08 98.17,35.94 80.01,35.94 73.66,29.59 73.66,24.26 68.2,18.8 62.36,18.8 v61.85,18.29
USBDP  (via drill 0.5)
  Top 0.254: R43.2 89.41,92.08 91.57,89.92 93.6,89.92 99.82,83.69 99.82,54.23 v98.68,53.09 | U3.33 60.05,20.21 60.83,19.43 v61.85,19.43
  Bottom 0.254: v98.68,53.09 98.68,37.34 97.92,36.58 79.76,36.58 73.03,29.84 73.03,24.51 67.94,19.43 v61.85,19.43
VCC  (via drill 0.5)  (1 unrouted)
  Top 0.813: v32.51,98.17 v33.78,98.17 v35.05,98.17 | v35.05,98.17 v36.32,98.17 | v35.05,98.17 35.05,96.51 U$6.P$2
  Bottom 0.813: 34.42,95.5 34.42,90.18 32.77,88.52 JP8.3
  Bottom 1.27: U$6.P$2 34.42,95.5 D1.A 26.54,98.93 25.91,99.57 24.13,99.57 23.11,100.58 JP14.2
VCC2
  Top 0.254: R11.2 U5.3
  Bottom 1.27: 17.4,95.38 14.35,95.38 3.81,84.84 3.81,50.16 U5.4 U5.3 | 17.4,95.38 21.34,95.38 21.34,95.5 D1.C | C9.+ 17.4,95.38
VCC3  (via drill 0.5)
  Top 0.813: v32.51,93.47 v33.78,93.47 v35.05,93.47 v36.32,93.47
VID1  (via drill 0.5)
  Top 0.254: U$2.VIDEO 80.81,38.02 80.9,38.1 80.94,38.14 R12.2 80.9,38.23 80.9,51.94 79.5,53.34 v61.72,53.34 61.72,64.26 60.71,65.28 60.71,72.14 61.21,72.64 IC5.3 | U6.6 46.56,56.06 47.24,55.37 47.24,53.47 v46.48,52.7
  Bottom 0.254: v61.72,53.34 61.72,48.39 59.18,45.85 52.32,45.85 46.48,51.69 v46.48,52.7
VID2  (via drill 0.5)
  Top 0.254: v43.81,50.93 46.74,50.93 47.88,52.07 47.88,55.75 46.94,56.69 U6.5 40.72,56.69 39.5,57.91 39.5,64.14 40.77,65.41 40.77,73.53 40.39,73.91 IC2.5
  Bottom 0.254: U$3.VIDEO 23.71,39.07 R9.2 | 23.62,39.24 23.62,40.51 25.02,41.91 41.66,41.91 44.2,44.45 44.2,50.55 v43.81,50.93
  Bottom 0.406: 23.37,39.08 R9.2 23.62,39.24 23.37,39.24
VID3  (via drill 0.5)
  Top 0.254: 23.83,68.71 R22.2 | U6.4 41.33,57.35 40.26,58.42 v40.26,63.37 42.04,65.15 42.04,72.26 42.42,72.64 IC2.3 | U$1.VIDEO 23.71,68.41 R22.2 | R22.2 23.75,68.58 v28.07,68.58
  Bottom 0.254: v28.07,68.58 32.26,68.58 37.47,63.37 v40.26,63.37
VID4  (via drill 0.5)
  Top 0.254: U6.3 46.69,57.99 47.24,58.55 v47.24,64.01 | IC5.5 58.93,73.91 59.44,73.41 59.44,64.14 v60.2,63.37
  Bottom 0.254: v47.24,64.01 49.53,64.01 50.55,62.99 59.94,62.99 60.2,63.25 v60.2,63.37 60.58,62.99 69.47,62.99 74.55,68.07 78.19,68.07 R23.2 78.19,68.03 | 78.19,68.03 | 78.19,68.03 78.36,68.07 80.01,68.07 80.81,68.88 U$4.VIDEO
VIDEO1
  Top 0.254: C26.- 63.12,86.74 | 63.12,86.87 63.12,86.74 | 63.12,86.74 66.17,89.79 68.07,89.79 68.96,90.68 JP4.1
VIDEO2
  Top 0.254: C32.- 37.92,86.82 40.51,89.41 48.13,89.41 50.55,91.82 | 50.29,91.57 50.55,91.82 | 50.55,91.82 60.45,91.82 JP9.1
VIDEO3
  Top 0.254: C33.- 46.35,86.74 50.8,91.19 62.36,91.19 JP7.1
VIDEO4
  Top 0.254: C24.- 54.74,86.74 | 54.74,86.87 54.74,86.74 | 54.74,86.74 59.44,86.74 63.12,90.42 65.28,90.42 66.42,91.57 JP10.1
VIDEOC  (via drill 0.5)
  Top 0.254: C37.- 75.82,78.49 74.8,77.47 74.8,73.03 73.28,71.5 v73.28,59.56
  Bottom 0.254: v73.28,59.56 73.28,46.61 73.91,45.97 U$5.VIN
VIDEOOUT  (via drill 0.5)
  Top 0.254: JP3.1 71.5,87.12 70.1,85.73 70.1,57.91 v70.87,57.15
  Bottom 0.254: v70.87,57.15 72.39,55.63 72.39,45.21 73.41,44.2 77.09,44.2 77.98,45.08 U$5.VOUT
VIDOUT  (via drill 0.5)
  Top 0.254: U6.7 42.01,55.4 42.04,55.37 41.94,55.4 v41.78,55.24 | IC3.5 81.03,89.15 78.61,89.15 73.28,83.82 73.28,74.55 71.88,73.15 v71.88,61.72
  Bottom 0.254: v41.78,55.24 41.27,55.75 41.27,60.07 41.66,60.45 42.55,61.47 42.8,61.72 v71.88,61.72

### Text on the board
tPlace: 2 | 3 | 1 | 2 | 3 | 4 | C | G | A | V | BATT | 5 | AnyDiversityPRO | BOOT | T | R | 5 | G | 3 | SK2015 | 4 | 1